# EAGLE board RADAR (EAGLE 7.4.0), part 1 of 4
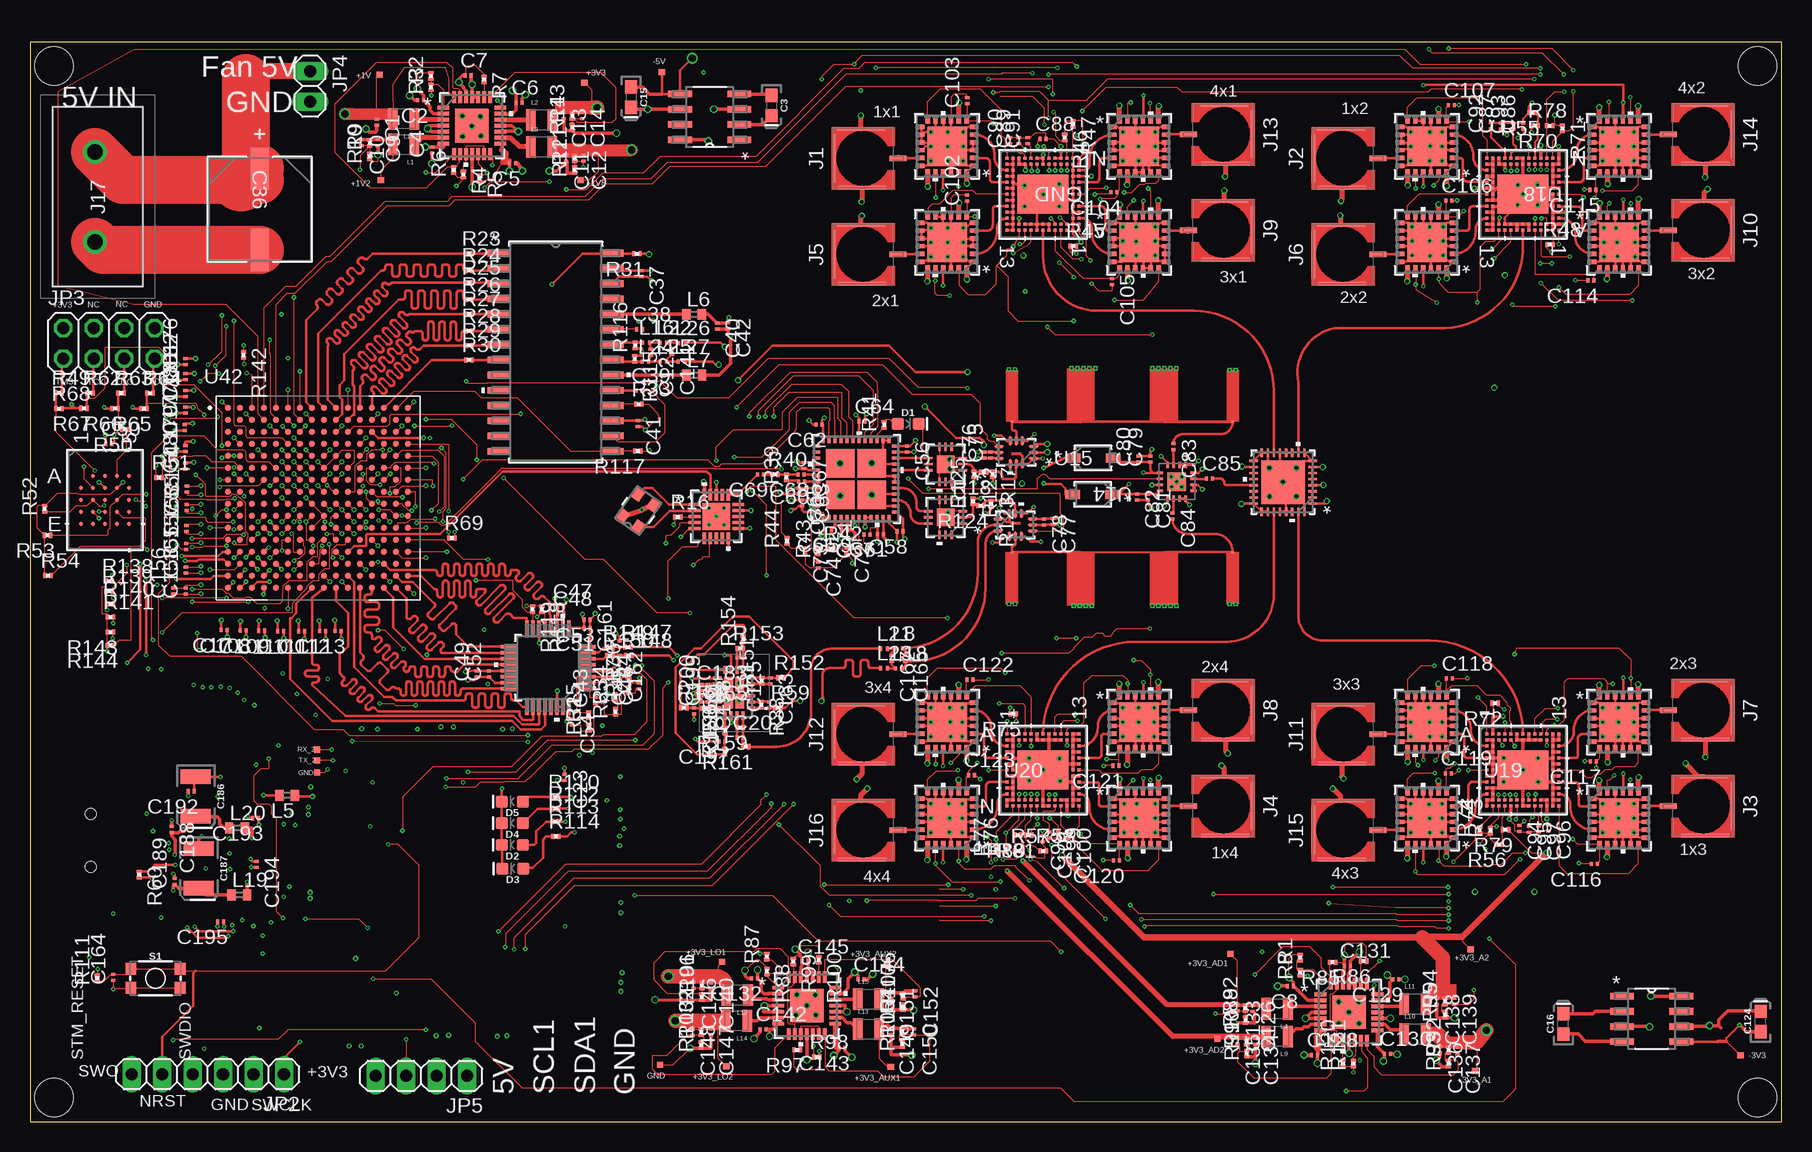
[diagram p11: board, top side]
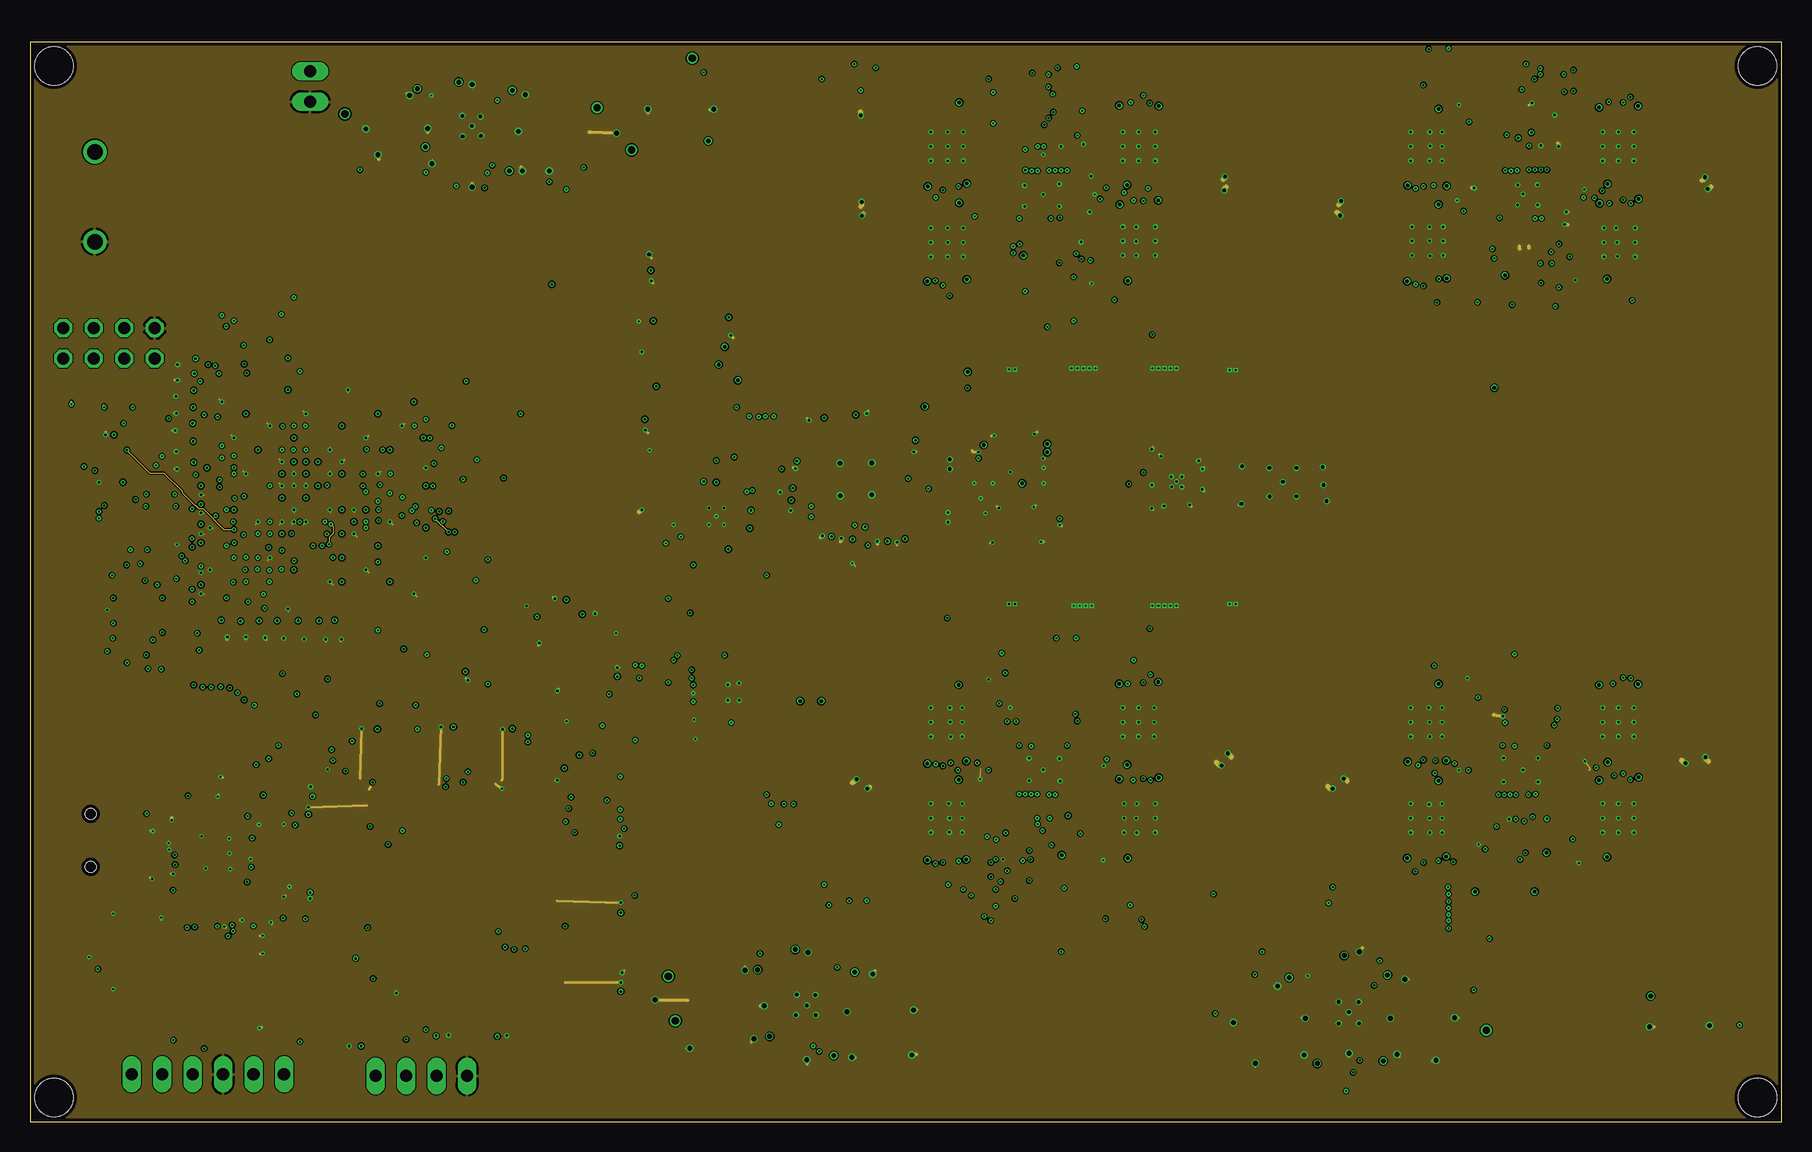
[diagram p12: board, inner layer Route2]
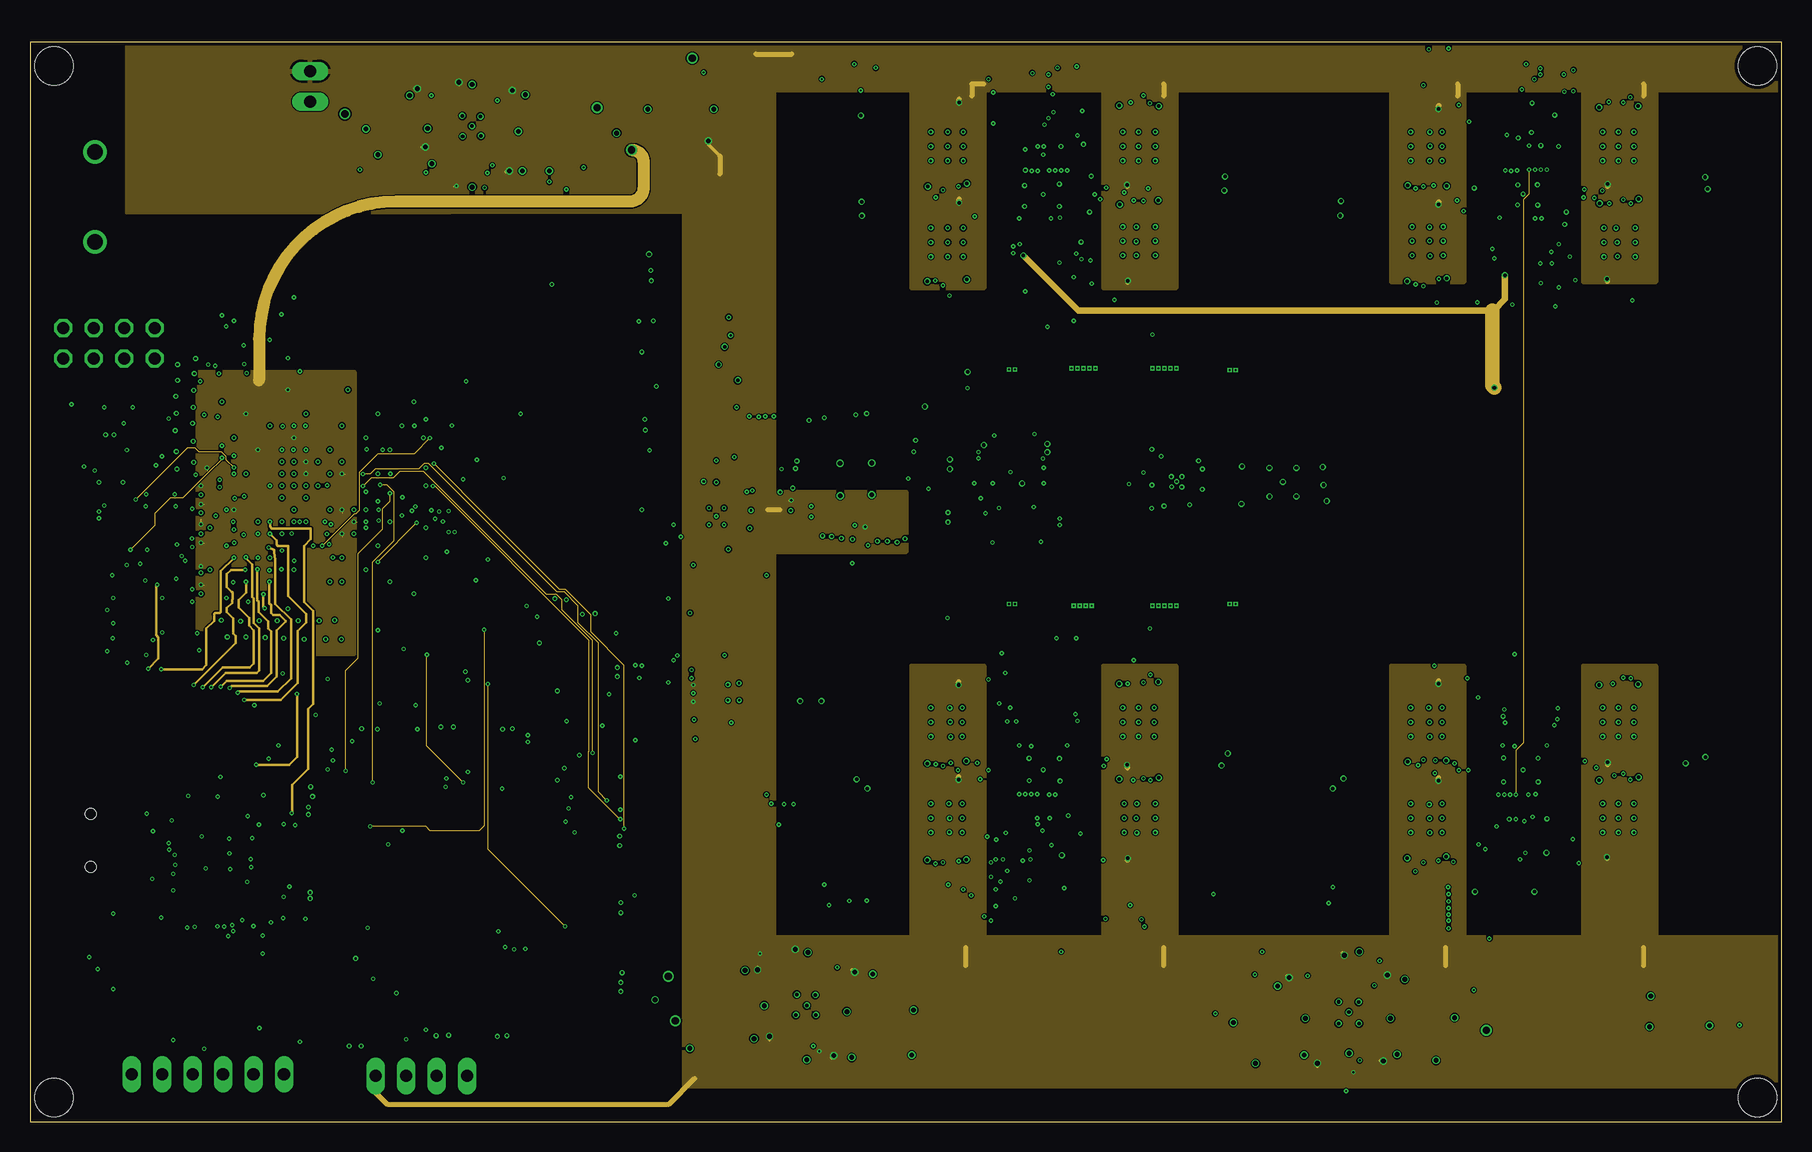
[diagram p13: board, inner layer Route3]
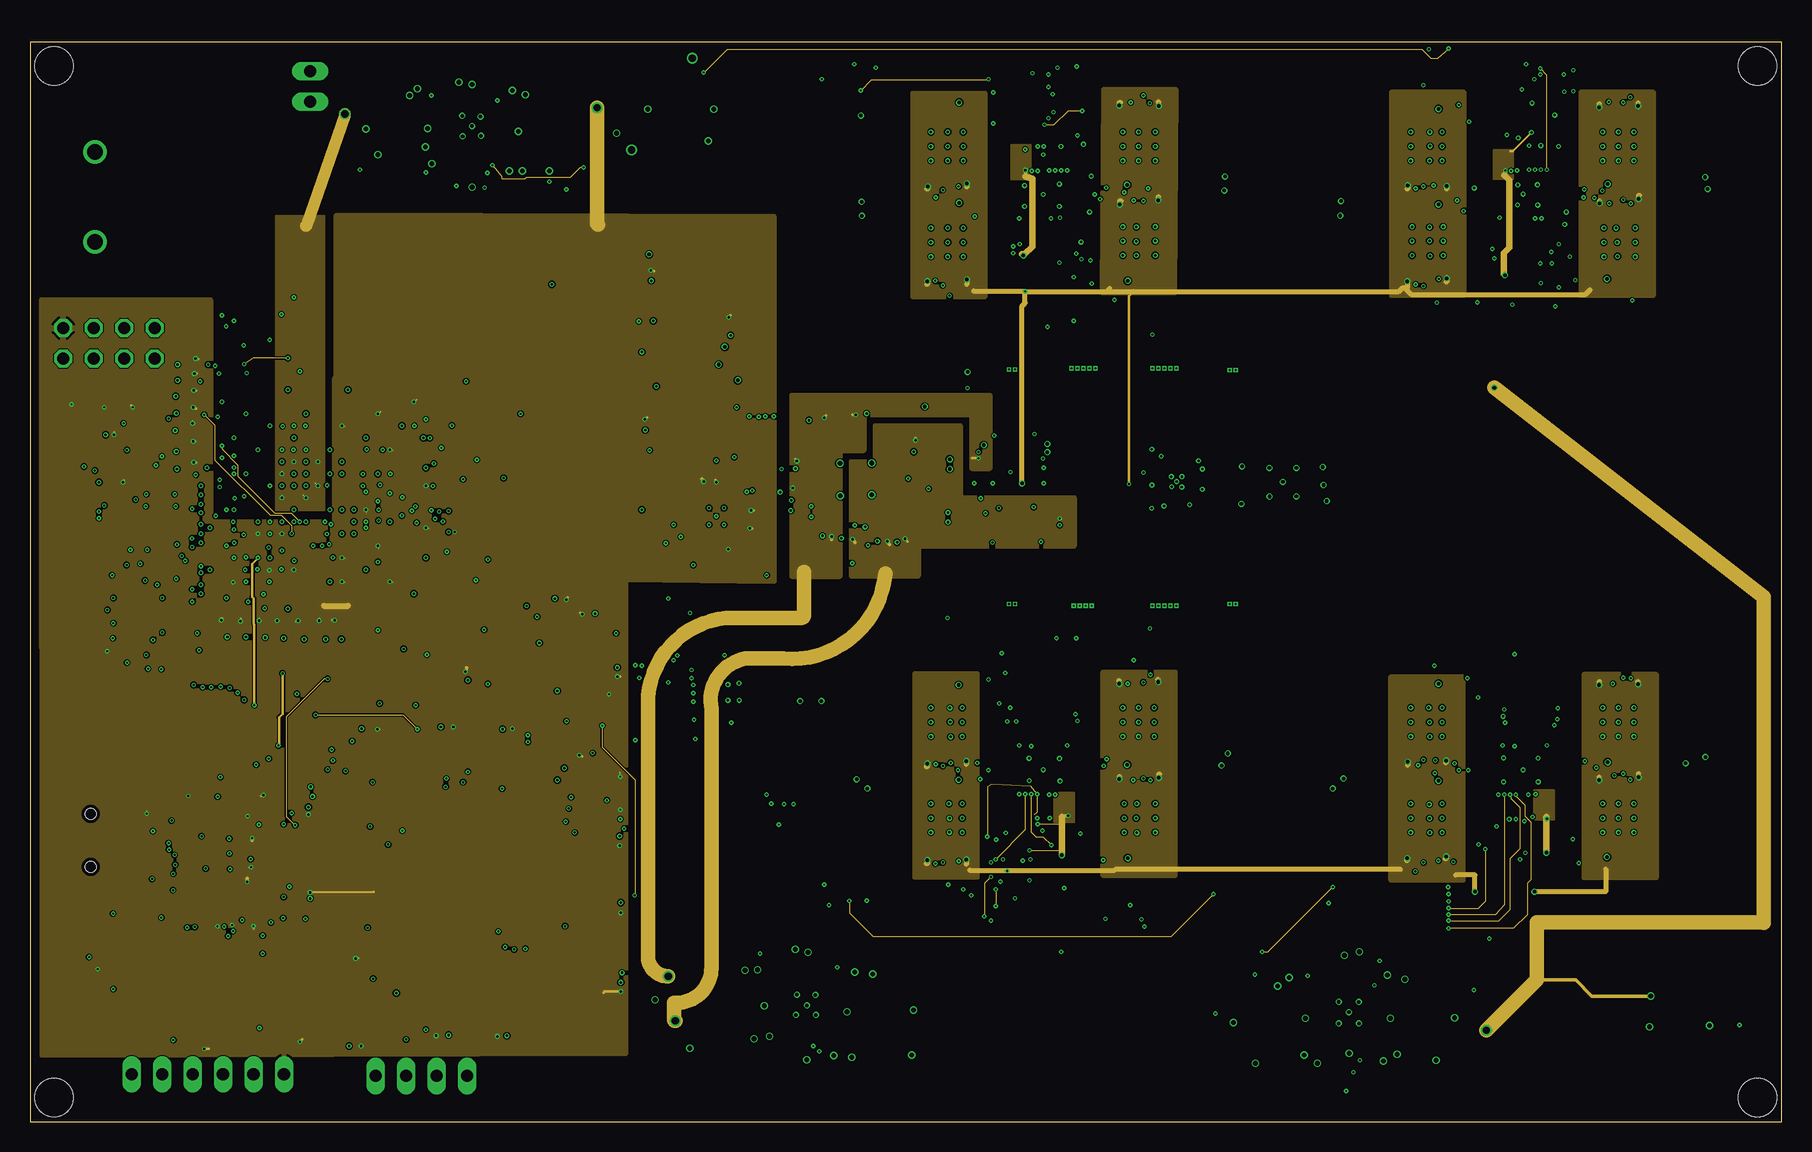
[diagram p14: board, inner layer Route14]
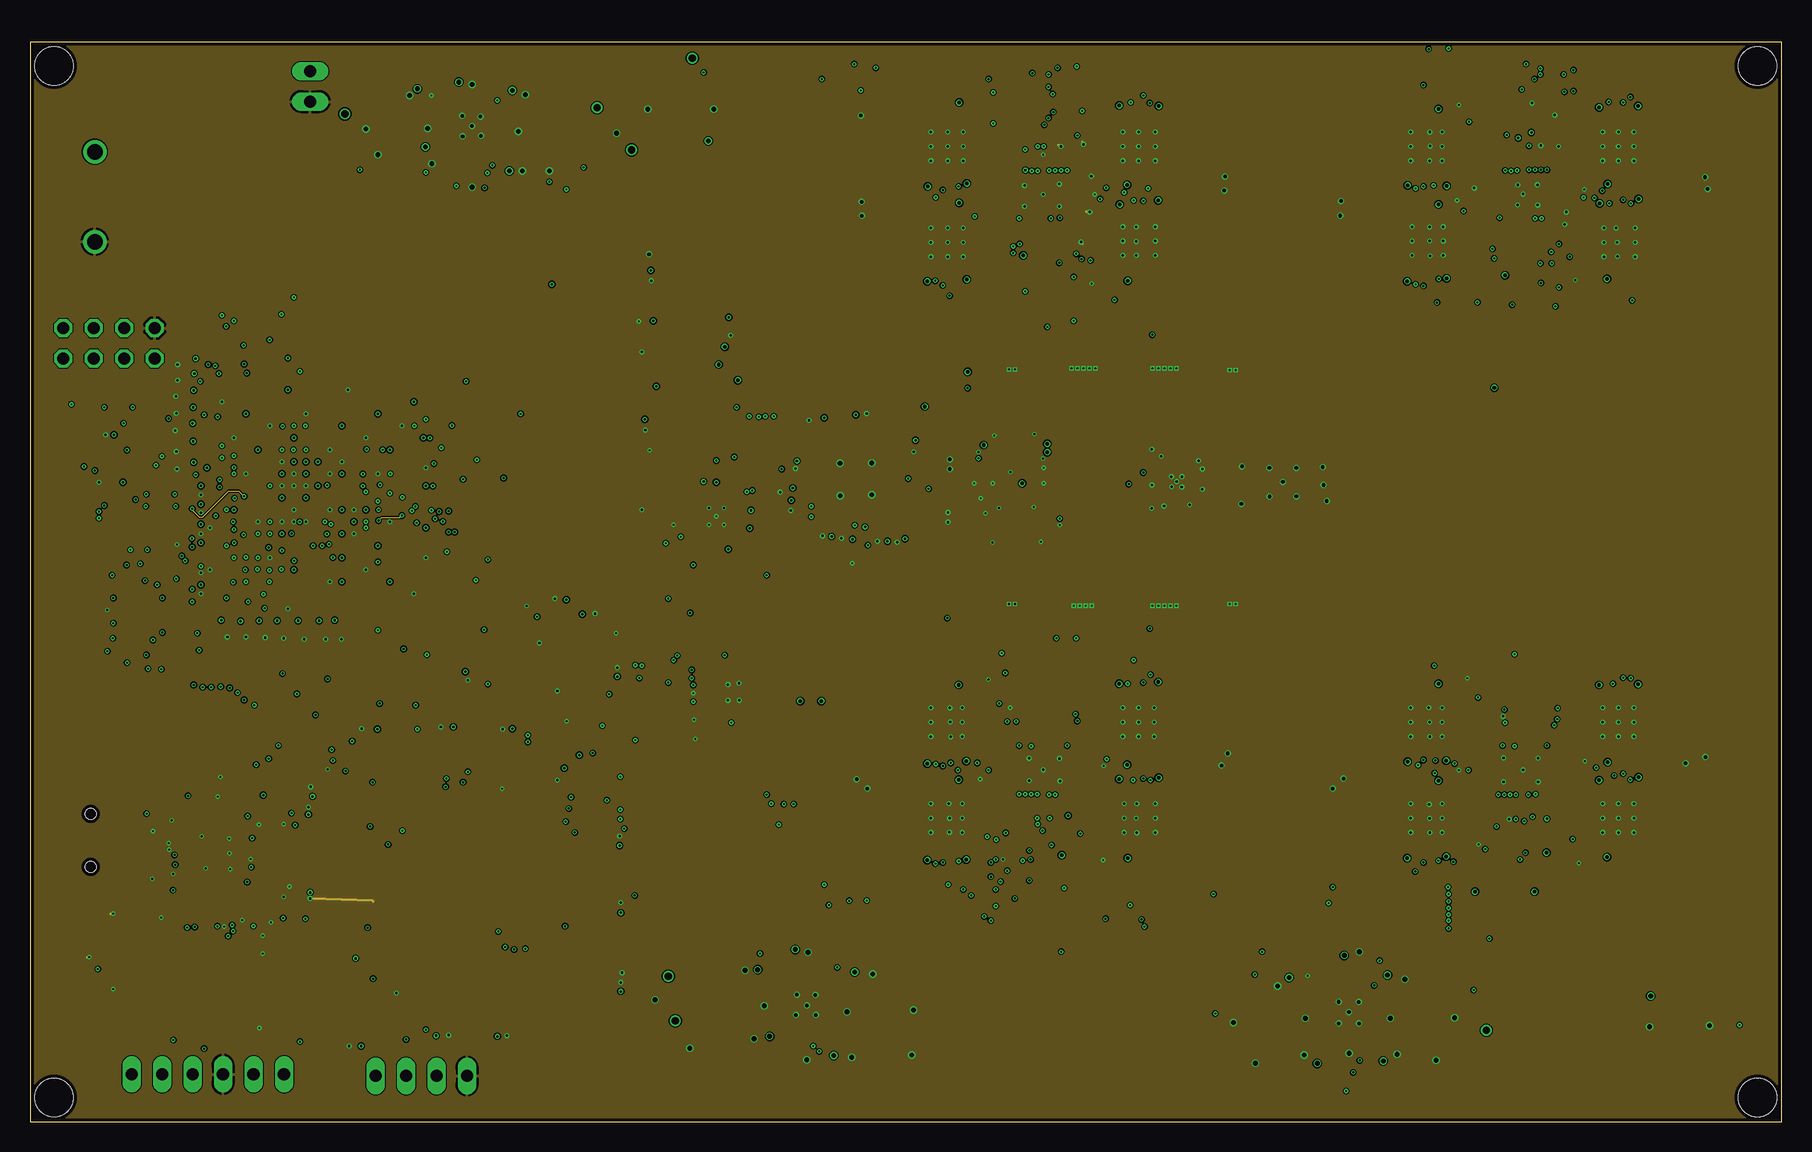
[diagram p15: board, inner layer Route15]
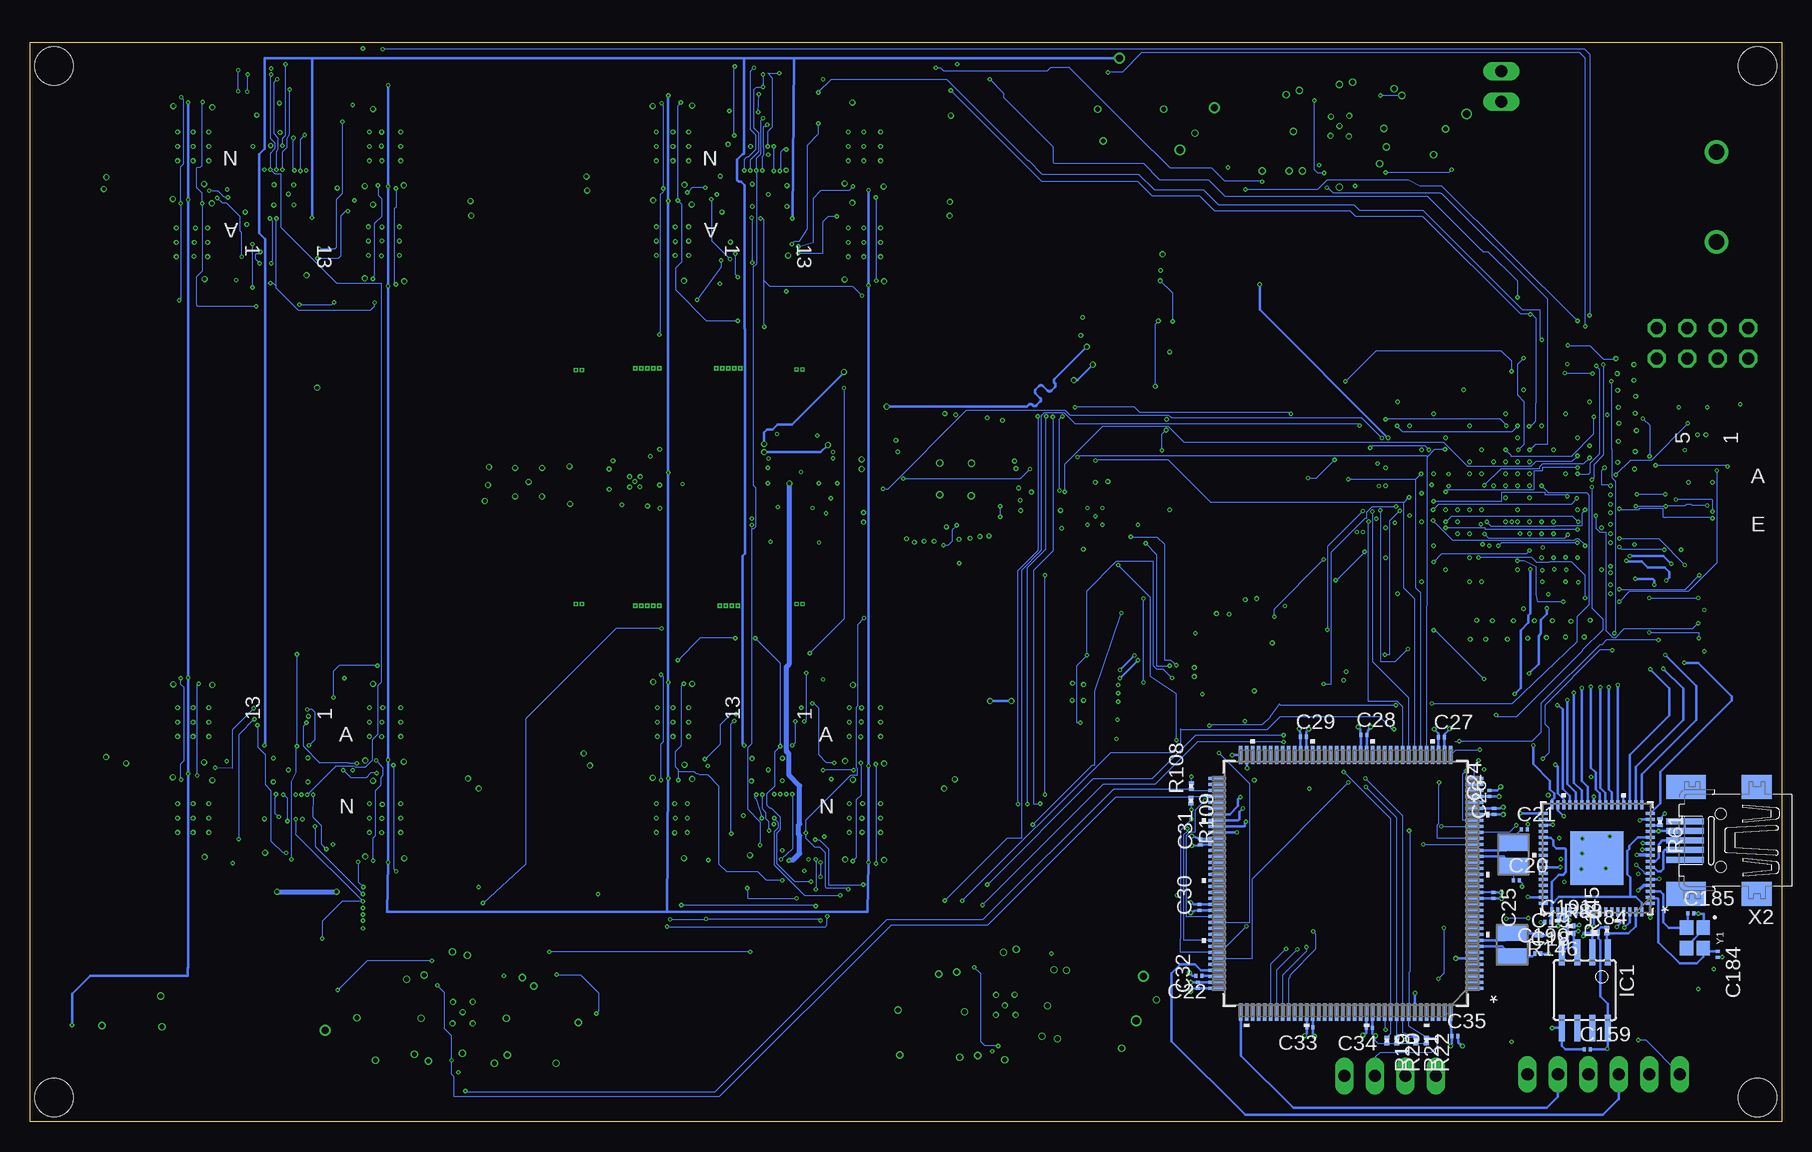
[diagram p16: board, bottom side, seen from below]

Size 146 x 90 mm. Coordinates in mm from the lower left corner, seen from the top.
Outline: 0,0 146,0 146,90 0,90 0,0
Copper layers (1*2+3*14+15*16): Top 0.035mm / dielectric 0.1mm / Route2 0.035mm / dielectric 0.695mm / Route3 0.035mm / dielectric 0.25mm / Route14 0.035mm / dielectric 0.6mm / Route15 0.035mm / dielectric 0.1mm / Bottom 0.035mm
Design rules "PCBWay_6L_100um-Track *": minimum track width 0.08mm, minimum drill 0.15mm, track to track 0.1mm, track to pad 0.1mm, pad to pad 0.1mm, via to via 0.1mm, smd to smd 0mil, copper to edge 0.3mm, drill to drill 10mil, minimum pad ring 6mil, minimum via ring 0.1mm, stop-mask expansion 2mil, vias tented up to drill 0.45mm, thermal gap 0.2mm
Holes 3.2 mm at 2,2 144,2 144,88 2,88

## Footprints (pad centres in the part's own frame; a part is rotated, then mirrored left to right if it is on the bottom)
C0201 = smd 0.25 x 0.35: 1 -0.25,0; 2 0.25,0
0603-POLAR = smd 1.1 x 1: + 0.85,0; - -0.85,0
PCAP_8X10-ELECT_NCA = smd 3.505 x 1.499: 1 -3.404,0; 2 3.404,0
EIA3528 = smd 1.2 x 2.5: A 1.65,0; C -1.65,0
LED-0603 = smd 1 x 1: A -0.877,0; C 0.877,0
CC-88-1_ADI = smd 4.242 x 3.251: 89 0,0 | smd 0.254 x 0.254: A1 -3,3; A2 -2.5,3; A3 -2,3; A4 -1.5,3; A5 -1,3; A6 -0.5,3; A7 0,3; A8 0.5,3; A9 1,3; A10 1.5,3; A11 2,3; A12 2.5,3; A13 3,3; B1 -3,2.5; B2 -2.5,2.5; B3 -2,2.5; B4 -1.5,2.5; B5 -1,2.5; B6 -0.5,2.5; B7 0,2.5; B8 0.5,2.5; B9 1,2.5; B10 1.5,2.5; B11 2,2.5; B12 2.5,2.5; B13 3,2.5; C1 -3,2; C2 -2.5,2; C12 2.5,2; C13 3,2; D1 -3,1.5; D2 -2.5,1.5; D12 2.5,1.5; D13 3,1.5; E1 -3,1; E2 -2.5,1; E12 2.5,1; E13 3,1; F1 -3,0.5; F2 -2.5,0.5; F12 2.5,0.5; F13 3,0.5; G1 -3,0; G2 -2.5,0; G12 2.5,0; G13 3,0; H1 -3,-0.5; H2 -2.5,-0.5; H12 2.5,-0.5; H13 3,-0.5; J1 -3,-1; J2 -2.5,-1; J12 2.5,-1; J13 3,-1; K1 -3,-1.5; K2 -2.5,-1.5; K12 2.5,-1.5; K13 3,-1.5; L1 -3,-2; L2 -2.5,-2; L12 2.5,-2; L13 3,-2; M1 -3,-2.5; M2 -2.5,-2.5; M3 -2,-2.5; M4 -1.5,-2.5; M5 -1,-2.5; M6 -0.5,-2.5; M7 0,-2.5; M8 0.5,-2.5; M9 1,-2.5; M10 1.5,-2.5; M11 2,-2.5; M12 2.5,-2.5; M13 3,-2.5; N1 -3,-3; N2 -2.5,-3; N3 -2,-3; N4 -1.5,-3; N5 -1,-3; N6 -0.5,-3; N7 0,-3; N8 0.5,-3; N9 1,-3; N10 1.5,-3; N11 2,-3; N12 2.5,-3; N13 3,-3
SOIC8 = smd 0.5 x 2.2: 1 -1.905,-3.154; 2 -0.645,-3.154; 3 0.625,-3.154; 4 1.895,-3.154; 5 1.905,3.154; 6 0.635,3.154; 7 -0.635,3.154; 8 -1.905,3.154
LTC6419IVPBF = smd 0.7 x 0.25: 1 -1.4,1.25; 2 -1.4,0.75; 3 -1.4,0.25; 4 -1.4,-0.25; 5 -1.4,-0.75; 6 -1.4,-1.25; 11 1.4,-1.25; 12 1.4,-0.75; 13 1.4,-0.25; 14 1.4,0.25; 15 1.4,0.75; 16 1.4,1.25 | smd 0.25 x 0.7: 7 -0.75,-1.9; 8 -0.25,-1.9; 9 0.25,-1.9; 10 0.75,-1.9; 17 0.75,1.9; 18 0.25,1.9; 19 -0.25,1.9; 20 -0.75,1.9 | smd 0.725 x 1.225: 21 -0.462,0.713; 22 0.463,0.713; 23 -0.462,-0.713; 24 0.463,-0.713
60124102122403 = smd 0.48 x 1.4: 1 0,-2.9 | smd 0.3 x 4: 2 -2.45,0.1; 4 2.45,0.2 | smd 4 x 0.3: 3 0,2.45
691137910002 = drill 1.3 pad 1.95: 1 0,0; 2 7.5,0
1X06 = drill 1.016 long: 1 -6.35,0; 2 -3.81,0; 3 -1.27,0; 4 1.27,0; 5 3.81,0; 6 6.35,0
2X04 = drill 1.016 octagon: 1 -3.81,-1.27; 2 -3.81,1.27; 3 -1.27,-1.27; 4 -1.27,1.27; 5 1.27,-1.27; 6 1.27,1.27; 7 3.81,-1.27; 8 3.81,1.27
1X02 = drill 1.016 long: 1 -1.27,0; 2 1.27,0
1X04 = drill 1.016 long: 1 -3.81,0; 2 -1.27,0; 3 1.27,0; 4 3.81,0
0806 = smd 0.8 x 1.8: 1 -0.9,0; 2 0.9,0
0402 = smd 0.7 x 0.9: 1 -0.65,0; 2 0.65,0
L0201 = smd 0.25 x 0.35: 1 -0.275,0; 2 0.275,0
R0201 = smd 0.28 x 0.43: 1 -0.255,0; 2 0.255,0
TACTILE_SWITCH_SMD_4.6X2.8MM = smd 0.9 x 1: 1 -2.05,-0.8; 2 2.05,-0.8; 3 2.05,0.8; 4 -2.05,0.8
PAD.02X.02 = smd 0.508 x 0.508: 1 0,0
21-0140L_T2855-5_MXM = smd 0.965 x 0.305: 1 -2.375,1.5; 2 -2.375,1; 3 -2.375,0.5; 4 -2.375,0; 5 -2.375,-0.5; 6 -2.375,-1; 7 -2.375,-1.5; 15 2.375,-1.5; 16 2.375,-1; 17 2.375,-0.5; 18 2.375,0; 19 2.375,0.5; 20 2.375,1; 21 2.375,1.5 | smd 0.305 x 0.965: 8 -1.5,-2.375; 9 -1,-2.375; 10 -0.5,-2.375; 11 0,-2.375; 12 0.5,-2.375; 13 1,-2.375; 14 1.5,-2.375; 22 1.5,2.375; 23 1,2.375; 24 0.5,2.375; 25 0,2.375; 26 -0.5,2.375; 27 -1,2.375; 28 -1.5,2.375 | smd 2.794 x 2.794: 29 0,0
LQFP-144_STM = smd 1.473 x 0.279: 1 -10.719,8.75; 2 -10.719,8.25; 3 -10.719,7.75; 4 -10.719,7.25; 5 -10.719,6.75; 6 -10.719,6.25; 7 -10.719,5.75; 8 -10.719,5.25; 9 -10.719,4.75; 10 -10.719,4.25; 11 -10.719,3.75; 12 -10.719,3.25; 13 -10.719,2.75; 14 -10.719,2.25; 15 -10.719,1.75; 16 -10.719,1.25; 17 -10.719,0.75; 18 -10.719,0.25; 19 -10.719,-0.25; 20 -10.719,-0.75; 21 -10.719,-1.25; 22 -10.719,-1.75; 23 -10.719,-2.25; 24 -10.719,-2.75; 25 -10.719,-3.25; 26 -10.719,-3.75; 27 -10.719,-4.25; 28 -10.719,-4.75; 29 -10.719,-5.25; 30 -10.719,-5.75; 31 -10.719,-6.25; 32 -10.719,-6.75; 33 -10.719,-7.25; 34 -10.719,-7.75; 35 -10.719,-8.25; 36 -10.719,-8.75; 73 10.719,-8.75; 74 10.719,-8.25; 75 10.719,-7.75; 76 10.719,-7.25; 77 10.719,-6.75; 78 10.719,-6.25; 79 10.719,-5.75; 80 10.719,-5.25; 81 10.719,-4.75; 82 10.719,-4.25; 83 10.719,-3.75; 84 10.719,-3.25; 85 10.719,-2.75; 86 10.719,-2.25; 87 10.719,-1.75; 88 10.719,-1.25; 89 10.719,-0.75; 90 10.719,-0.25; 91 10.719,0.25; 92 10.719,0.75; 93 10.719,1.25; 94 10.719,1.75; 95 10.719,2.25; 96 10.719,2.75; 97 10.719,3.25; 98 10.719,3.75; 99 10.719,4.25; 100 10.719,4.75; 101 10.719,5.25; 102 10.719,5.75; 103 10.719,6.25; 104 10.719,6.75; 105 10.719,7.25; 106 10.719,7.75; 107 10.719,8.25; 108 10.719,8.75 | smd 0.279 x 1.473: 37 -8.75,-10.719; 38 -8.25,-10.719; 39 -7.75,-10.719; 40 -7.25,-10.719; 41 -6.75,-10.719; 42 -6.25,-10.719; 43 -5.75,-10.719; 44 -5.25,-10.719; 45 -4.75,-10.719; 46 -4.25,-10.719; 47 -3.75,-10.719; 48 -3.25,-10.719; 49 -2.75,-10.719; 50 -2.25,-10.719; 51 -1.75,-10.719; 52 -1.25,-10.719; 53 -0.75,-10.719; 54 -0.25,-10.719; 55 0.25,-10.719; 56 0.75,-10.719; 57 1.25,-10.719; 58 1.75,-10.719; 59 2.25,-10.719; 60 2.75,-10.719; 61 3.25,-10.719; 62 3.75,-10.719; 63 4.25,-10.719; 64 4.75,-10.719; 65 5.25,-10.719; 66 5.75,-10.719; 67 6.25,-10.719; 68 6.75,-10.719; 69 7.25,-10.719; 70 7.75,-10.719; 71 8.25,-10.719; 72 8.75,-10.719; 109 8.75,10.719; 110 8.25,10.719; 111 7.75,10.719; 112 7.25,10.719; 113 6.75,10.719; 114 6.25,10.719; 115 5.75,10.719; 116 5.25,10.719; 117 4.75,10.719; 118 4.25,10.719; 119 3.75,10.719; 120 3.25,10.719; 121 2.75,10.719; 122 2.25,10.719; 123 1.75,10.719; 124 1.25,10.719; 125 0.75,10.719; 126 0.25,10.719; 127 -0.25,10.719; 128 -0.75,10.719; 129 -1.25,10.719; 130 -1.75,10.719; 131 -2.25,10.719; 132 -2.75,10.719; 133 -3.25,10.719; 134 -3.75,10.719; 135 -4.25,10.719; 136 -4.75,10.719; 137 -5.25,10.719; 138 -5.75,10.719; 139 -6.25,10.719; 140 -6.75,10.719; 141 -7.25,10.719; 142 -7.75,10.719; 143 -8.25,10.719; 144 -8.75,10.719
RW_28_ADI = smd 1.981 x 0.559: 1 -4.686,8.255; 2 -4.686,6.985; 3 -4.686,5.715; 4 -4.686,4.445; 5 -4.686,3.175; 6 -4.686,1.905; 7 -4.686,0.635; 8 -4.686,-0.635; 9 -4.686,-1.905; 10 -4.686,-3.175; 11 -4.686,-4.445; 12 -4.686,-5.715; 13 -4.686,-6.985; 14 -4.686,-8.255; 15 4.686,-8.255; 16 4.686,-6.985; 17 4.686,-5.715; 18 4.686,-4.445; 19 4.686,-3.175; 20 4.686,-1.905; 21 4.686,-0.635; 22 4.686,0.635; 23 4.686,1.905; 24 4.686,3.175; 25 4.686,4.445; 26 4.686,5.715; 27 4.686,6.985; 28 4.686,8.255
21-0110B_MXM = smd 1.346 x 0.279: 1 -3.277,1.75; 2 -3.277,1.25; 3 -3.277,0.75; 4 -3.277,0.25; 5 -3.277,-0.25; 6 -3.277,-0.75; 7 -3.277,-1.25; 8 -3.277,-1.75; 17 3.277,-1.75; 18 3.277,-1.25; 19 3.277,-0.75; 20 3.277,-0.25; 21 3.277,0.25; 22 3.277,0.75; 23 3.277,1.25; 24 3.277,1.75 | smd 0.279 x 1.346: 9 -1.75,-3.277; 10 -1.25,-3.277; 11 -0.75,-3.277; 12 -0.25,-3.277; 13 0.25,-3.277; 14 0.75,-3.277; 15 1.25,-3.277; 16 1.75,-3.277; 25 1.75,3.277; 26 1.25,3.277; 27 0.75,3.277; 28 0.25,3.277; 29 -0.25,3.277; 30 -0.75,3.277; 31 -1.25,3.277; 32 -1.75,3.277
UDB_12_ADI = smd 0.813 x 0.254: 1 -1.448,0.5; 2 -1.448,0; 3 -1.448,-0.5; 7 1.448,-0.5; 8 1.448,0; 9 1.448,0.5 | smd 0.254 x 0.813: 4 -0.5,-0.953; 5 0,-0.953; 6 0.5,-0.953; 10 0.5,0.953; 11 0,0.953; 12 -0.5,0.953
64QFN_FT2232HQ_FTD = smd 0.755 x 0.254: 1 -4.461,3.75; 2 -4.461,3.25; 3 -4.461,2.75; 4 -4.461,2.25; 5 -4.461,1.75; 6 -4.461,1.25; 7 -4.461,0.75; 8 -4.461,0.25; 9 -4.461,-0.25; 10 -4.461,-0.75; 11 -4.461,-1.25; 12 -4.461,-1.75; 13 -4.461,-2.25; 14 -4.461,-2.75; 15 -4.461,-3.25; 16 -4.461,-3.75; 33 4.461,-3.75; 34 4.461,-3.25; 35 4.461,-2.75; 36 4.461,-2.25; 37 4.461,-1.75; 38 4.461,-1.25; 39 4.461,-0.75; 40 4.461,-0.25; 41 4.461,0.25; 42 4.461,0.75; 43 4.461,1.25; 44 4.461,1.75; 45 4.461,2.25; 46 4.461,2.75; 47 4.461,3.25; 48 4.461,3.75 | smd 0.254 x 0.755: 17 -3.75,-4.461; 18 -3.25,-4.461; 19 -2.75,-4.461; 20 -2.25,-4.461; 21 -1.75,-4.461; 22 -1.25,-4.461; 23 -0.75,-4.461; 24 -0.25,-4.461; 25 0.25,-4.461; 26 0.75,-4.461; 27 1.25,-4.461; 28 1.75,-4.461; 29 2.25,-4.461; 30 2.75,-4.461; 31 3.25,-4.461; 32 3.75,-4.461; 49 3.75,4.461; 50 3.25,4.461; 51 2.75,4.461; 52 2.25,4.461; 53 1.75,4.461; 54 1.25,4.461; 55 0.75,4.461; 56 0.25,4.461; 57 -0.25,4.461; 58 -0.75,4.461; 59 -1.25,4.461; 60 -1.75,4.461; 61 -2.25,4.461; 62 -2.75,4.461; 63 -3.25,4.461; 64 -3.75,4.461 | smd 4.445 x 4.445: 65 0,0
CC-48-10_ADI = smd 0.457 x 0.254: 1 -3.226,2.75; 2 -3.226,2.25; 3 -3.226,1.75; 4 -3.226,1.25; 5 -3.226,0.75; 6 -3.226,0.25; 7 -3.226,-0.25; 8 -3.226,-0.75; 9 -3.226,-1.25; 10 -3.226,-1.75; 11 -3.226,-2.25; 12 -3.226,-2.75; 25 3.226,-2.75; 26 3.226,-2.25; 27 3.226,-1.75; 28 3.226,-1.25; 29 3.226,-0.75; 30 3.226,-0.25; 31 3.226,0.25; 32 3.226,0.75; 33 3.226,1.25; 34 3.226,1.75; 35 3.226,2.25; 36 3.226,2.75 | smd 0.254 x 0.457: 13 -2.75,-3.226; 14 -2.25,-3.226; 15 -1.75,-3.226; 16 -1.25,-3.226; 17 -0.75,-3.226; 18 -0.25,-3.226; 19 0.25,-3.226; 20 0.75,-3.226; 21 1.25,-3.226; 22 1.75,-3.226; 23 2.25,-3.226; 24 2.75,-3.226; 37 2.75,3.226; 38 2.25,3.226; 39 1.75,3.226; 40 1.25,3.226; 41 0.75,3.226; 42 0.25,3.226; 43 -0.25,3.226; 44 -0.75,3.226; 45 -1.25,3.226; 46 -1.75,3.226; 47 -2.25,3.226; 48 -2.75,3.226 | smd 2.388 x 2.388: 49 -1.312,1.312; 50 -1.312,-1.312; 51 1.312,-1.312; 52 1.312,1.312
M08A = smd 1.981 x 0.559: 1 -2.464,1.905; 2 -2.464,0.635; 3 -2.464,-0.635; 4 -2.464,-1.905; 5 2.464,-1.905; 6 2.464,-0.635; 7 2.464,0.635; 8 2.464,1.905
BGA24_MT25QL_MRN = smd 0.33 x 0.33: A2 -1,2; A3 0,2; A4 1,2; A5 2,2; B1 -2,1; B2 -1,1; B3 0,1; B4 1,1; B5 2,1; C1 -2,0; C2 -1,0; C3 0,0; C4 1,0; C5 2,0; D1 -2,-1; D2 -1,-1; D3 0,-1; D4 1,-1; D5 2,-1; E1 -2,-2; E2 -1,-2; E3 0,-2; E4 1,-2; E5 2,-2
QFN20_SIL = smd 0.965 x 0.254: 1 -1.816,1; 2 -1.816,0.5; 3 -1.816,0; 4 -1.816,-0.5; 5 -1.816,-1; 11 1.816,-1; 12 1.816,-0.5; 13 1.816,0; 14 1.816,0.5; 15 1.816,1 | smd 0.254 x 0.965: 6 -1,-1.816; 7 -0.5,-1.816; 8 0,-1.816; 9 0.5,-1.816; 10 1,-1.816; 16 1,1.816; 17 0.5,1.816; 18 0,1.816; 19 -0.5,1.816; 20 -1,1.816 | smd 2.261 x 2.261: 21 0,0
DQ1225_MNC = smd 0.711 x 0.178: 1 -1.448,0.508; 2 -1.448,0; 3 -1.448,-0.508; 7 1.448,-0.508; 8 1.448,0; 9 1.448,0.508 | smd 0.178 x 0.711: 4 -0.508,-1.448; 5 0,-1.448; 6 0.508,-1.448; 10 0.508,1.448; 11 0,1.448; 12 -0.508,1.448 | smd 1.448 x 1.448: 13 0,0
SOD-123_ONS = smd 1.219 x 0.762: 1 -1.676,0; 2 1.676,0
DG1677-2_MNC = smd 0.711 x 0.178: 1 -2.451,1.778; 2 -2.451,1.27; 3 -2.451,0.762; 4 -2.451,0.254; 5 -2.451,-0.254; 6 -2.451,-0.762; 7 -2.451,-1.27; 8 -2.451,-1.778; 17 2.451,-1.778; 18 2.451,-1.27; 19 2.451,-0.762; 20 2.451,-0.254; 21 2.451,0.254; 22 2.451,0.762; 23 2.451,1.27; 24 2.451,1.778 | smd 0.178 x 0.711: 9 -1.778,-2.451; 10 -1.27,-2.451; 11 -0.762,-2.451; 12 -0.254,-2.451; 13 0.254,-2.451; 14 0.762,-2.451; 15 1.27,-2.451; 16 1.778,-2.451; 25 1.778,2.451; 26 1.27,2.451; 27 0.762,2.451; 28 0.254,2.451; 29 -0.254,2.451; 30 -0.762,2.451; 31 -1.27,2.451; 32 -1.778,2.451 | smd 3.607 x 3.607: 33 0,0
CC-24-8_ADI = smd 0.508 x 0.356: 1 -2.146,1.625; 2 -2.146,0.975; 3 -2.146,0.325; 4 -2.146,-0.325; 5 -2.146,-0.975; 6 -2.146,-1.625; 13 2.146,-1.625; 14 2.146,-0.975; 15 2.146,-0.325; 16 2.146,0.325; 17 2.146,0.975; 18 2.146,1.625 | smd 0.356 x 0.508: 7 -1.625,-2.146; 8 -0.975,-2.146; 9 -0.325,-2.146; 10 0.325,-2.146; 11 0.975,-2.146; 12 1.625,-2.146; 19 1.625,2.146; 20 0.975,2.146; 21 0.325,2.146; 22 -0.325,2.146; 23 -0.975,2.146; 24 -1.625,2.146 | smd 3.302 x 3.302: 25 0,0
BGA256C100P16X16_1700X1700X155 = smd 0.45 x 0.45: A1 -7.5,7.5; A2 -6.5,7.5; A3 -5.5,7.5; A4 -4.5,7.5; A5 -3.5,7.5; A6 -2.5,7.5; A7 -1.5,7.5; A8 -0.5,7.5; A9 0.5,7.5; A10 1.5,7.5; A11 2.5,7.5; A12 3.5,7.5; A13 4.5,7.5; A14 5.5,7.5; A15 6.5,7.5; A16 7.5,7.5; B1 -7.5,6.5; B2 -6.5,6.5; B3 -5.5,6.5; B4 -4.5,6.5; B5 -3.5,6.5; B6 -2.5,6.5; B7 -1.5,6.5; B8 -0.5,6.5; B9 0.5,6.5; B10 1.5,6.5; B11 2.5,6.5; B12 3.5,6.5; B13 4.5,6.5; B14 5.5,6.5; B15 6.5,6.5; B16 7.5,6.5; C1 -7.5,5.5; C2 -6.5,5.5; C3 -5.5,5.5; C4 -4.5,5.5; C5 -3.5,5.5; C6 -2.5,5.5; C7 -1.5,5.5; C8 -0.5,5.5; C9 0.5,5.5; C10 1.5,5.5; C11 2.5,5.5; C12 3.5,5.5; C13 4.5,5.5; C14 5.5,5.5; C15 6.5,5.5; C16 7.5,5.5; D1 -7.5,4.5; D2 -6.5,4.5; D3 -5.5,4.5; D4 -4.5,4.5; D5 -3.5,4.5; D6 -2.5,4.5; D7 -1.5,4.5; D8 -0.5,4.5; D9 0.5,4.5; D10 1.5,4.5; D11 2.5,4.5; D12 3.5,4.5; D13 4.5,4.5; D14 5.5,4.5; D15 6.5,4.5; D16 7.5,4.5; E1 -7.5,3.5; E2 -6.5,3.5; E3 -5.5,3.5; E4 -4.5,3.5; E5 -3.5,3.5; E6 -2.5,3.5; E7 -1.5,3.5; E8 -0.5,3.5; E9 0.5,3.5; E10 1.5,3.5; E11 2.5,3.5; E12 3.5,3.5; E13 4.5,3.5; E14 5.5,3.5; E15 6.5,3.5; E16 7.5,3.5; F1 -7.5,2.5; F2 -6.5,2.5; F3 -5.5,2.5; F4 -4.5,2.5; F5 -3.5,2.5; F6 -2.5,2.5; F7 -1.5,2.5; F8 -0.5,2.5; F9 0.5,2.5; F10 1.5,2.5; F11 2.5,2.5; F12 3.5,2.5; F13 4.5,2.5; F14 5.5,2.5; F15 6.5,2.5; F16 7.5,2.5; G1 -7.5,1.5; G2 -6.5,1.5; G3 -5.5,1.5; G4 -4.5,1.5; G5 -3.5,1.5; G6 -2.5,1.5; G7 -1.5,1.5; G8 -0.5,1.5; G9 0.5,1.5; G10 1.5,1.5; G11 2.5,1.5; G12 3.5,1.5; G13 4.5,1.5; G14 5.5,1.5; G15 6.5,1.5; G16 7.5,1.5; H1 -7.5,0.5; H2 -6.5,0.5; H3 -5.5,0.5; H4 -4.5,0.5; H5 -3.5,0.5; H6 -2.5,0.5; H7 -1.5,0.5; H8 -0.5,0.5; H9 0.5,0.5; H10 1.5,0.5; H11 2.5,0.5; H12 3.5,0.5; H13 4.5,0.5; H14 5.5,0.5; H15 6.5,0.5; H16 7.5,0.5; J1 -7.5,-0.5; J2 -6.5,-0.5; J3 -5.5,-0.5; J4 -4.5,-0.5; J5 -3.5,-0.5; J6 -2.5,-0.5; J7 -1.5,-0.5; J8 -0.5,-0.5; J9 0.5,-0.5; J10 1.5,-0.5; J11 2.5,-0.5; J12 3.5,-0.5; J13 4.5,-0.5; J14 5.5,-0.5; J15 6.5,-0.5; J16 7.5,-0.5; K1 -7.5,-1.5; K2 -6.5,-1.5; K3 -5.5,-1.5; K4 -4.5,-1.5; K5 -3.5,-1.5; K6 -2.5,-1.5; K7 -1.5,-1.5; K8 -0.5,-1.5; K9 0.5,-1.5; K10 1.5,-1.5; K11 2.5,-1.5; K12 3.5,-1.5; K13 4.5,-1.5; K14 5.5,-1.5; K15 6.5,-1.5; K16 7.5,-1.5; L1 -7.5,-2.5; L2 -6.5,-2.5; L3 -5.5,-2.5; L4 -4.5,-2.5; L5 -3.5,-2.5; L6 -2.5,-2.5; L7 -1.5,-2.5; L8 -0.5,-2.5; L9 0.5,-2.5; L10 1.5,-2.5; L11 2.5,-2.5; L12 3.5,-2.5; L13 4.5,-2.5; L14 5.5,-2.5; L15 6.5,-2.5; L16 7.5,-2.5; M1 -7.5,-3.5; M2 -6.5,-3.5; M3 -5.5,-3.5; M4 -4.5,-3.5; M5 -3.5,-3.5; M6 -2.5,-3.5; M7 -1.5,-3.5; M8 -0.5,-3.5; M9 0.5,-3.5; M10 1.5,-3.5; M11 2.5,-3.5; M12 3.5,-3.5; M13 4.5,-3.5; M14 5.5,-3.5; M15 6.5,-3.5; M16 7.5,-3.5; N1 -7.5,-4.5; N2 -6.5,-4.5; N3 -5.5,-4.5; N4 -4.5,-4.5; N5 -3.5,-4.5; N6 -2.5,-4.5; N7 -1.5,-4.5; N8 -0.5,-4.5; N9 0.5,-4.5; N10 1.5,-4.5; N11 2.5,-4.5; N12 3.5,-4.5; N13 4.5,-4.5; N14 5.5,-4.5; N15 6.5,-4.5; N16 7.5,-4.5; P1 -7.5,-5.5; P2 -6.5,-5.5; P3 -5.5,-5.5; P4 -4.5,-5.5; P5 -3.5,-5.5; P6 -2.5,-5.5; P7 -1.5,-5.5; P8 -0.5,-5.5; P9 0.5,-5.5; P10 1.5,-5.5; P11 2.5,-5.5; P12 3.5,-5.5; P13 4.5,-5.5; P14 5.5,-5.5; P15 6.5,-5.5; P16 7.5,-5.5; R1 -7.5,-6.5; R2 -6.5,-6.5; R3 -5.5,-6.5; R4 -4.5,-6.5; R5 -3.5,-6.5; R6 -2.5,-6.5; R7 -1.5,-6.5; R8 -0.5,-6.5; R9 0.5,-6.5; R10 1.5,-6.5; R11 2.5,-6.5; R12 3.5,-6.5; R13 4.5,-6.5; R14 5.5,-6.5; R15 6.5,-6.5; R16 7.5,-6.5; T1 -7.5,-7.5; T2 -6.5,-7.5; T3 -5.5,-7.5; T4 -4.5,-7.5; T5 -3.5,-7.5; T6 -2.5,-7.5; T7 -1.5,-7.5; T8 -0.5,-7.5; T9 0.5,-7.5; T10 1.5,-7.5; T11 2.5,-7.5; T12 3.5,-7.5; T13 4.5,-7.5; T14 5.5,-7.5; T15 6.5,-7.5; T16 7.5,-7.5
16_QFN = smd 0.5 x 0.22: 1 -1.4,0.74; 2 -1.4,0.24; 3 -1.4,-0.26; 4 -1.4,-0.76; 9 1.4,-0.76; 10 1.4,-0.26; 11 1.4,0.24; 12 1.4,0.74 | smd 0.22 x 0.5: 5 -0.74,-1.4; 6 -0.24,-1.4; 7 0.26,-1.4; 8 0.76,-1.4; 13 0.76,1.4; 14 0.26,1.4; 15 -0.24,1.4; 16 -0.74,1.4 | smd 1.54 x 1.54: 17 0,0
BPF2 = smd 0.169 x 0.169: P$1 0,0.1; P$2 18.415,0.1
32005-201 = smd 3.1 x 0.5: 1 3,1.6; 2 3,0.8; 3 3,0; 4 3,-0.8; 5 3,-1.6 | smd 2.5 x 2: M1 -3,-4.45; M2 -3,4.45 | smd 3.3 x 2: M3 2.9,4.45; M4 2.9,-4.45 | hole 0.9: 0,2.2; 0,-2.2
XTAL_NX3225GD-8MHZ-STD-CRA-3_N = smd 1.295 x 2.388: 1 -0.953,0; 2 0.953,0
XTAL4_CX3225SB_AVX = smd 0.762 x 1.092: 1 -0.762,1.15; 2 0.762,1.15; 3 0.762,-1.15; 4 -0.762,-1.15
CRYSTAL-SMD-2X2.5MM = smd 1.2 x 1.1: P1 0.846,0.69; P2 -0.854,0.69; P3 -0.854,-0.71; P4 0.846,-0.71

## Placement (x,y rotation side)
C1  47uF  [C0201]  28.91,83.32 270 top
C2  4.7uF  [C0201]  32.57,85.14 180 top
C3  47uF  [0603-POLAR]  61.8,84.7 270 top
C4  4.7uF  [C0201]  33.51,80.98 90 top
C5  4.7uF  [C0201]  40.24,79.9 180 top
C6  4.7uF  [C0201]  40.76,84.95 0 top
C7  1uF  [C0201]  36.5,87.21 0 top
C8  4.7uF  [C0201]  105.08,11.3 180 top
C9  47uF  [C0201]  28.97,81.6 270 top
C10  75pF  [C0201]  27.63,81.6 270 top
C11  47uF  [C0201]  44.69,80.3 270 top
C12  18pF  [C0201]  46.14,80.32 270 top
C13  47uF  [C0201]  44.48,83.85 270 top
C14  15pF  [C0201]  46.03,83.87 270 top
C15  47uF  [0603-POLAR]  50.1,85.4 270 top
C16  47uF  [0603-POLAR]  127.8,8.15 90 top
C17  47uF  [C0201]  16.18,40.99 180 top
C18  2.7pF  [C0201]  20.3,14 0 bottom
C19  2.7pF  [C0201]  20.25,15.51 0 bottom
C20  4.3pF  [C0201]  22.12,20.1 0 bottom
C21  4.3pF  [C0201]  21.45,24.36 0 bottom
C22  2.2uF  [C0201]  48.55,12.15 180 bottom
C23  2.2uF  [C0201]  44.57,28.7 270 top
C24  100nF  [C0201]  24.36,27.35 90 bottom
C25  100nF  [C0201]  24.03,18.85 270 bottom
C26  100nF  [C0201]  23.96,25.85 90 bottom
C27  100nF  [C0201]  28.35,32.05 0 bottom
C28  100nF  [C0201]  34.8,32.24 0 bottom
C29  100nF  [C0201]  39.85,32.08 0 bottom
C30  100nF  [C0201]  48.52,17.85 90 bottom
C31  47nF  [C0201]  48.46,23.3 90 bottom
C32  100nF  [C0201]  48.65,11.35 90 bottom
C33  100nF  [C0201]  39.3,7.86 180 bottom
C34  100nF  [C0201]  34.35,7.82 180 bottom
C35  100nF  [C0201]  27.25,7.12 0 bottom
C36  100µF  [PCAP_8X10-ELECT_NCA]  19.15,76.05 270 top
C37  10uF  [C0201]  50.95,70.7 270 top
C38  0.1uF  [C0201]  50.8,66.05 0 top
C39  0.1uF  [C0201]  50.75,60.95 0 top
C40  10uF  [C0201]  57.29,66.3 270 top
C41  0.1uF  [C0201]  50.67,58.18 270 top
C42  0.1uF  [C0201]  58.17,66.35 270 top
C43  0.1uF  [C0201]  47.12,35.12 90 top
C44  0.1uF  [C0201]  50.75,36.32 90 top
C45  0.1uF  [C0201]  47.77,37.33 270 top
C46  2.2uF  [C0201]  48.39,37.33 270 top
C47  0.1uF  [C0201]  44.22,42.96 0 top
C48  2.2uF  [C0201]  44.22,42.33 0 top
C49  0.1uF  [C0201]  37.25,37.32 90 top
C50  100nF  [C0201]  6.55,56.5 0 top
C51  2.2uF  [C0201]  46.43,41.13 180 top
C52  2.2uF  [C0201]  38.26,37.32 90 top
C53  0.1uF  [C0201]  46.43,41.84 180 top
C54  0.1uF  [C0201]  45.18,33.33 270 top
C55  47uF  [C0201]  13.06,51.2 90 top
C56  4.7uF  [C0201]  73.1,56.08 270 top
C57  0.1uF  [C0201]  69.78,48.93 180 top
C58  4.7uF  [C0201]  72.53,49.21 180 top
C59  4.7uF  [C0201]  67.88,49.33 180 top
C60  1uF  [C0201]  64.3,53.35 180 top
C61  4.7uF  [C0201]  70.88,48.98 180 top
C62  4.7uF  [C0201]  65.78,58.11 180 top
C63  4.7uF  [C0201]  64.74,52.57 270 top
C64  4.7uF  [C0201]  69.37,58.37 0 top
C65  4.7uF  [C0201]  64.08,52.57 270 top
C66  4.7uF  [C0201]  66.57,49.36 180 top
C67  4.7uF  [C0201]  64.5,54.68 270 top
C68  1uF  [C0201]  64.25,53.95 180 top
C69  1uF  [C0201]  60.9,53.95 180 top
C70  1uF  [C0201]  64.35,51.55 270 top
C71  20pF  [C0201]  69.15,47.55 90 top
C72  33pF  [C0201]  68.05,47.55 270 top
C73  10pF  [C0201]  64.6,47.55 270 top
C74  10nF  [C0201]  65.7,46.4 270 top
C75  18pF  [C0201]  80.09,55.56 90 top
C76  1uF  [C0201]  79.54,55.55 90 top
C77  18pF  [C0201]  85.26,50.01 270 top
C78  1uF  [C0201]  84.53,50 270 top
C79  100pF  [C0201]  93.39,55.22 90 top
C80  0.1uF  [C0201]  92.4,55.22 90 top
C81  100pF  [C0201]  93.18,52.08 270 top
C82  0.1uF  [C0201]  92.26,52.08 270 top
C83  1pF  [C0201]  95.32,56.28 270 top
C84  1pF  [C0201]  95.24,50.48 270 top
C85  1pF  [C0201]  98.32,53.61 0 top
C86  1uF  [C0201]  124.47,82.97 90 top
C87  1uF  [C0201]  122.62,83 90 top
C88  1uF  [C0201]  84.42,81.92 0 top
C89  1uF  [C0201]  82.41,81.77 90 top
C90  1uF  [C0201]  81.69,81.77 90 top
C91  1uF  [C0201]  83.17,81.77 90 top
C92  1uF  [C0201]  121.77,83.03 90 top
C93  1uF  [C0201]  123.62,82.96 90 top
C94  1uF  [C0201]  124.15,24.45 270 top
C95  1uF  [C0201]  124.95,24.37 270 top
C96  1uF  [C0201]  126.55,24.49 270 top
C97  1uF  [C0201]  125.75,24.41 270 top
C98  1uF  [C0201]  84.4,23.58 270 top
C99  1uF  [C0201]  85.7,23.9 270 top
C100  1uF  [C0201]  86.56,23.84 270 top
C101  1uF  [C0201]  84.95,23.88 270 top
C102  10nF  [C0201]  78.11,76.97 90 top
C103  10nF  [C0201]  78.12,85.12 90 top
C104  10nF  [C0201]  90.34,77.47 180 top
C105  10nF  [C0201]  90.18,70.03 270 top
C106  10nF  [C0201]  118.27,76.78 0 top
C107  10nF  [C0201]  118.49,84.73 0 top
C108  4.7uF  [C0201]  17.78,40.95 180 top
C109  4.7uF  [C0201]  19.33,40.91 180 top
C110  0.47uF  [C0201]  20.88,40.87 180 top
C111  0.47uF  [C0201]  22.63,40.88 180 top
C112  0.47uF  [C0201]  24.38,40.89 180 top
C113  0.47uF  [C0201]  25.68,40.9 180 top
C114  10nF  [C0201]  130.09,70.12 180 top
C115  10nF  [C0201]  130.28,77.67 180 top
C116  10nF  [C0201]  130.38,21.47 180 top
C117  10nF  [C0201]  130.33,30.02 180 top
C118  10nF  [C0201]  118.31,36.93 0 top
C119  10nF  [C0201]  118.22,29.03 0 top
C120  10nF  [C0201]  90.58,21.77 180 top
C121  10nF  [C0201]  90.53,29.67 180 top
C122  10nF  [C0201]  78.36,36.83 0 top
C123  10nF  [C0201]  78.47,28.88 0 top
C124  47uF  [0603-POLAR]  144.25,8.35 90 top
C125  0.4pF  [C0201]  61.6,34.75 90 top
C126  47uF  [C0201]  101.92,9.43 270 top
C127  3.2nF  [C0201]  51.75,64.15 270 top
C128  4.7uF  [C0201]  107.06,5.54 0 top
C129  4.7uF  [C0201]  113.84,11.86 180 top
C130  4.7uF  [C0201]  113.16,5.64 0 top
C131  1uF  [C0201]  109.81,12.99 0 top
C132  4.7uF  [C0201]  60.4,11.95 180 top
C133  15pF  [C0201]  100.65,9.48 270 top
C134  47uF  [C0201]  102.16,6.68 270 top
C135  15pF  [C0201]  100.64,6.68 270 top
C136  47uF  [C0201]  117.53,5.98 270 top
C137  15pF  [C0201]  118.98,5.95 270 top
C138  47uF  [C0201]  117.28,10.02 270 top
C139  15pF  [C0201]  118.71,10.03 270 top
C140  47uF  [C0201]  56.76,11.33 270 top
C141  3.2nF  [C0201]  53.5,64.2 270 top
C142  4.7uF  [C0201]  61.12,7.7 0 top
C143  4.7uF  [C0201]  67.7,6.15 180 top
C144  4.7uF  [C0201]  69.27,11.85 0 top
C145  1uF  [C0201]  64.62,13.33 0 top
C146  15pF  [C0201]  55.31,11.35 270 top
C147  47uF  [C0201]  56.76,7.47 270 top
C148  15pF  [C0201]  55.21,7.44 270 top
C149  47uF  [C0201]  71.79,7.53 270 top
C150  15pF  [C0201]  73.69,7.5 270 top
C151  47uF  [C0201]  71.79,10.52 270 top
C152  15pF  [C0201]  73.79,10.64 270 top
C153  4.7uF  [C0201]  13.04,49.45 90 top
C154  4.7uF  [C0201]  13.09,52.75 90 top
C155  0.47uF  [C0201]  13,46 90 top
C156  0.47uF  [C0201]  11.95,44.22 90 top
C157  0.47uF  [C0201]  13.02,47.95 90 top
C158  0.47uF  [C0201]  12.97,44.22 90 top
C159  0.1uF  [C0201]  16.2,6.03 0 bottom
C161  15pF  [C0201]  49.15,39.8 90 top
C162  15pF  [C0201]  49.15,38.6 270 top
C163  0.4pF  [C0201]  61.7,36.75 270 top
C164  2.2uF  [C0201]  6.94,12.04 90 top
C165  6pF  [C0201]  72.96,38.61 270 top
C167  15pF  [C0201]  71.83,38.61 270 top
C176  47uF  [C0201]  12.95,63.35 90 top
C177  4.7uF  [C0201]  12.9,57.85 90 top
C178  4.7uF  [C0201]  12.95,59.3 90 top
C179  0.47uF  [C0201]  12.95,56.1 90 top
C180  0.47uF  [C0201]  12.95,54.65 90 top
C181  0.47uF  [C0201]  12.95,60.7 90 top
C182  0.47uF  [C0201]  12.95,62.1 90 top
C183  0.4pF  [C0201]  59.2,38.7 180 top
C184  12pF  [C0201]  5.33,13.95 270 bottom
C185  12pF  [C0201]  7.55,17.35 0 bottom
C186  4.7uF 35V  [EIA3528]  13.82,27.1 270 top
C187  4.7uF 35V  [EIA3528]  14.07,21.1 270 top
C188  0.1uF  [C0201]  11.8,24.35 270 top
C189  0.1uF  [C0201]  12.05,20.02 90 top
C190  0.1uF  [C0201]  18.38,16.8 180 bottom
C191  3.3uF  [C0201]  19.48,16.62 0 bottom
C192  0.1uF  [C0201]  13.43,27.55 180 top
C193  0.1uF  [C0201]  18.82,25.3 180 top
C194  0.1uF  [C0201]  18.88,21.45 270 top
C195  0.1uF  [C0201]  15.88,16.68 180 top
C196  15pF  [C0201]  55.35,34.25 270 top
C197  15pF  [C0201]  57.7,31.7 180 top
C198  0.1uF  [C0201]  56.5,36.2 270 top
C199  1nF  [C0201]  56.5,35.25 90 top
C200  1nF  [C0201]  55.95,35.25 90 top
C201  0.1uF  [C0201]  55.95,36.2 270 top
C202  0.4pF  [C0201]  59.2,32 0 top
D1  Blue  [LED-0603]  73.2,58.15 0 top
D2  Blue  [LED-0603]  40.21,23.06 180 top
D3  Blue  [LED-0603]  40.25,21.1 180 top
D4  Blue  [LED-0603]  40.21,24.87 180 top
D5  Blue  [LED-0603]  40.21,26.68 180 top
GND  ADAR1000ACCZN  [CC-88-1_ADI]  84.45,77.3 180 top
IC1  AT93C46A-10SQ-2.7  [SOIC8]  16.4,10.95 180 bottom
IC2  LTC6419IV#PBF  [LTC6419IVPBF]  58.7,35.75 180 top
J1  60124102122403  [60124102122403]  69.45,80.3 90 top
J2  60124102122403  [60124102122403]  109.45,80.3 90 top
J3  60124102122403  [60124102122403]  139.45,26.3 270 top
J4  60124102122403  [60124102122403]  99.45,26.3 270 top
J5  60124102122403  [60124102122403]  69.45,72.3 90 top
J6  60124102122403  [60124102122403]  109.45,72.3 90 top
J7  60124102122403  [60124102122403]  139.45,34.3 270 top
J8  60124102122403  [60124102122403]  99.45,34.3 270 top
J9  60124102122403  [60124102122403]  99.45,74.3 270 top
J10  60124102122403  [60124102122403]  139.45,74.3 270 top
J11  60124102122403  [60124102122403]  109.45,32.3 90 top
J12  60124102122403  [60124102122403]  69.45,32.3 90 top
J13  60124102122403  [60124102122403]  99.45,82.3 270 top
J14  60124102122403  [60124102122403]  139.45,82.3 270 top
J15  60124102122403  [60124102122403]  109.45,24.3 90 top
J16  60124102122403  [60124102122403]  69.45,24.3 90 top
J17  691137910002  [691137910002]  5.4,73.35 90 top
JP2  [1X06]  14.82,3.94 180 top
JP3  [2X04]  6.58,64.88 0 top
JP4  FAN  [1X02]  23.35,86.3 270 top
JP5  LCD  [1X04]  32.62,3.8 180 top
L1  1.5µH  [0806]  31.15,81.45 180 top
L2  1.5µH  [0806]  42.65,83.5 0 top
L3  1.5µH  [0806]  42.65,81.25 0 top
L4  1.5µH  [0806]  103.95,9.4 180 top
L5  BLM15HB121SN1  [0402]  21.43,27.2 180 top
L6  BLM15HB121SN1  [0402]  55.35,67.3 0 top
L7  BLM15HB121SN1  [0402]  55.37,62.22 0 top
L8  75nH  [L0201]  72.44,39.44 0 top
L9  1.5µH  [0806]  103.95,7.1 180 top
L10  1.5µH  [0806]  115.45,7.3 0 top
L11  1.5µH  [0806]  115.45,9.8 0 top
L12  1.5µH  [0806]  58.95,10.55 180 top
L13  1.5µH  [0806]  69.9,7.7 0 top
L14  1.5µH  [0806]  58.9,8.4 180 top
L15  1.5µH  [0806]  69.9,10.2 0 top
L16  2.5nH  [L0201]  51.35,64.95 0 top
L17  1.5µH  [0806]  31.15,83.6 180 top
L18  75nH  [L0201]  72.44,37.77 0 top
L19  BLM15HB121SN1  [0402]  17.45,18.9 0 top
L20  BLM15HB121SN1  [0402]  17.25,24.48 0 top
L21  30nH  [L0201]  71.19,39.42 0 top
L22  8nH  [L0201]  52.8,64.95 0 top
L23  30nH  [L0201]  71.19,37.8 0 top
L24  2.5nH  [L0201]  51.3,63.35 0 top
L25  8nH  [L0201]  52.8,63.35 0 top
L26  2.5nH  [L0201]  54.35,64.9 0 top
L27  2.5nH  [L0201]  54.3,63.35 0 top
R1  5k  [R0201]  105.88,13.66 90 top
R2  20k  [R0201]  33.42,87.18 90 top
R3  5k  [R0201]  33.43,86.23 90 top
R4  10k  [R0201]  36.13,78.94 270 top
R5  10k  [R0201]  37.47,78.64 270 top
R6  10k  [R0201]  35.31,79.33 90 top
R7  10k  [R0201]  37.85,86.87 270 top
R8  20k  [R0201]  105.88,12.43 90 top
R9  2k  [R0201]  28.32,81.58 90 top
R10  10k  [R0201]  28.31,80.45 90 top
R11  8k  [R0201]  45.39,80.3 90 top
R12  10k  [R0201]  45.39,79.33 90 top
R13  23k  [R0201]  45.2,83.85 90 top
R14  10k  [R0201]  45.2,82.88 90 top
R15  1k  [R0201]  46.55,33.87 90 top
R16  1k  [R0201]  54,50.4 0 top
R17  294R  [R0201]  80.25,53.95 270 top
R18  17.8R  [R0201]  79.5,54.15 180 top
R19  10k  [R0201]  32.9,6.75 270 bottom
R20  10k  [R0201]  32.06,6.75 270 bottom
R21  10k  [R0201]  30.47,6.75 270 bottom
R22  10k  [R0201]  29.6,6.75 270 bottom
R23  22R  [R0201]  36.6,72.36 0 top
R24  22R  [R0201]  36.6,70.95 0 top
R25  22R  [R0201]  36.6,69.94 0 top
R26  22R  [R0201]  36.6,68.53 0 top
R27  22R  [R0201]  36.6,67.32 0 top
R28  22R  [R0201]  36.6,65.91 0 top
R29  22R  [R0201]  36.6,64.7 0 top
R30  22R  [R0201]  36.6,63.49 0 top
R31  50R  [R0201]  50.6,72.35 180 top
R32  525R  [R0201]  46.58,32.82 90 top
R33  3k2  [R0201]  50.75,59.8 0 top
R34  1k  [R0201]  48.78,35.37 90 top
R35  1.9k  [R0201]  48.8,34.17 90 top
R36  1k  [R0201]  49.87,37.27 90 top
R37  1k  [R0201]  49.89,35.97 90 top
R38  500R  [R0201]  60.95,34.75 270 top
R39  50R  [R0201]  63.05,53.7 90 top
R40  100R  [R0201]  62.1,53.95 0 top
R41  500R  [R0201]  71.2,58.1 90 top
R42  30R  [R0201]  66.75,47.75 0 top
R43  330R  [R0201]  65.7,47.55 90 top
R44  0R  [R0201]  63.1,48.4 90 top
R45  4.7k  [R0201]  86.97,72.99 0 top
R46  4.7k  [R0201]  86.25,82.03 270 top
R47  4.7k  [R0201]  86.94,83.18 270 top
R48  4.7k  [R0201]  126.69,73.11 0 top
R49  22R  [R0201]  2.4,60.75 0 top
R50  4.7k  [R0201]  7.9,57.7 180 top
R51  22R  [R0201]  10.75,53.69 0 top
R52  4.7k  [R0201]  1.22,51.1 90 top
R53  4.7k  [R0201]  1.45,48.88 180 top
R54  4.7k  [R0201]  1.5,45.51 0 top
R55  1k  [R0201]  125.2,84.1 180 top
R56  1k  [R0201]  122.45,23.1 180 top
R57  1k  [R0201]  82.35,22.55 0 top
R58  1k  [R0201]  84.45,22.55 0 top
R59  25R  [R0201]  62.35,34.5 0 top
R60  1k2_1%  [R0201]  9.1,20.6 270 top
R61  1k  [R0201]  10.12,24.98 270 bottom
R62  22R  [R0201]  5,60.74 0 top
R63  22R  [R0201]  7.6,60.73 0 top
R64  22R  [R0201]  10,60.72 0 top
R65  4.7k  [R0201]  9.5,59.44 180 top
R66  4.7k  [R0201]  7.1,59.45 180 top
R67  4.7k  [R0201]  4.5,59.46 180 top
R68  4.7k  [R0201]  2.4,59.43 0 top
R69  4.7k  [R0201]  35.15,48.65 0 top
R70  4.7k  [R0201]  126.68,83.01 180 top
R71  4.7k  [R0201]  127.74,82.8 270 top
R72  4.7k  [R0201]  122.12,34.87 180 top
R73  4.7k  [R0201]  121.74,24.27 90 top
R74  4.7k  [R0201]  120.84,24.3 90 top
R75  4.7k  [R0201]  81.97,33.99 180 top
R76  4.7k  [R0201]  81.34,22.71 90 top
R77  4.7k  [R0201]  80.54,22.69 90 top
R78  840R  [R0201]  125.47,83.03 0 top
R79  840R  [R0201]  122.98,24.33 180 top
R80  840R  [R0201]  82.33,23.88 180 top
R81  840R  [R0201]  83.23,23.87 180 top
R82  23k  [R0201]  101.3,9.45 90 top
R83  10k  [R0201]  17.57,16.3 0 bottom
R84  10k  [R0201]  15.53,15.78 0 bottom
R85  10k  [R0201]  108.58,13.28 180 top
R86  10k  [R0201]  111.15,13.38 180 top
R87  5k  [R0201]  61.42,13.75 90 top
R88  20k  [R0201]  61.43,12.52 270 top
R89  10k  [R0201]  101.32,8.47 90 top
R90  23k  [R0201]  101.41,6.65 90 top
R91  10k  [R0201]  101.43,5.67 90 top
R92  23k  [R0201]  118.24,5.95 90 top
R93  10k  [R0201]  118.24,4.83 90 top
R94  23k  [R0201]  117.96,10.02 90 top
R95  10k  [R0201]  117.96,8.9 90 top
R96  23k  [R0201]  56.01,11.34 90 top
R97  10k  [R0201]  63.94,5.97 180 top
R98  10k  [R0201]  65.59,5.38 0 top
R99  10k  [R0201]  63.63,13.33 270 top
R100  10k  [R0201]  65.75,13.48 270 top
R101  10k  [R0201]  56,10.37 90 top
R102  23k  [R0201]  55.95,7.45 90 top
R103  10k  [R0201]  55.95,6.38 90 top
R104  23k  [R0201]  72.72,7.52 90 top
R105  10k  [R0201]  72.72,6.45 90 top
R106  23k  [R0201]  72.77,10.48 90 top
R107  10k  [R0201]  72.77,9.56 90 top
R108  10k  [R0201]  49.2,27.95 90 bottom
R109  10k  [R0201]  49.23,26.76 270 bottom
R110  500R  [R0201]  43.8,27.05 0 top
R111  10k  [R0201]  5.6,11.95 90 top
R112  500R  [R0201]  43.79,26.08 0 top
R113  500R  [R0201]  43.79,25 0 top
R114  500R  [R0201]  43.84,23.77 0 top
R115  50R  [R0201]  50.4,63.6 270 top
R116  50R  [R0201]  50.45,64.7 90 top
R117  4.7k  [R0201]  50.65,55.9 180 top
R118  4.7k  [R0201]  42.66,42.71 270 top
R119  4.7k  [R0201]  41.89,42.71 270 top
R120  10k  [R0201]  109.44,4.84 90 top
R121  10k  [R0201]  110.31,4.84 90 top
R122  294R  [R0201]  78.7,53.95 270 top
R123  294R  [R0201]  80.1,51.5 270 top
R124  17.8R  [R0201]  79.25,51.35 180 top
R125  294R  [R0201]  78.6,51.7 90 top
R138  1k  [R0201]  6.6,45.05 0 top
R139  1k  [R0201]  6.6,44.2 0 top
R140  1k  [R0201]  6.7,43.15 0 top
R141  4.7k  [R0201]  6.7,42.05 0 top
R142  4.7k  [R0201]  17.8,63.9 270 top
R143  4.7k  [R0201]  6.7,40.8 180 top
R144  1k  [R0201]  6.7,39.7 180 top
R145  10k  [R0201]  14.55,15.93 90 bottom
R146  2.2k  [R0201]  17.57,15.7 180 bottom
R147  50R  [R0201]  49.85,39.55 0 top
R148  50R  [R0201]  49.9,38.85 0 top
R149  50R  [R0201]  48.35,39.5 0 top
R150  50R  [R0201]  48.35,38.85 0 top
R151  500R  [R0201]  61,36.75 90 top
R152  25R  [R0201]  62.6,37 0 top
R153  500R  [R0201]  59.2,39.45 0 top
R154  25R  [R0201]  59.45,40.2 90 top
R155  50R  [R0201]  56.2,34.45 0 top
R156  50R  [R0201]  57.95,32.6 90 top
R157  50R  [R0201]  54.5,34.5 0 top
R158  50R  [R0201]  57.9,30.85 90 top
R159  500R  [R0201]  59.2,32.85 180 top
R161  25R  [R0201]  59.65,31.25 180 top
S1  MOMENTARY-SWITCH-SPST-SMD-4.6X2.8MM  [TACTILE_SWITCH_SMD_4.6X2.8MM]  10.46,11.94 0 top
TP1  TP  [PAD.02X.02]  52.67,87.47 0 top
TP2  TP  [PAD.02X.02]  142.58,5.52 90 top
TP3  TP  [PAD.02X.02]  29.14,87.27 90 top
TP4  TP  [PAD.02X.02]  29.25,78.47 90 top
TP5  TP  [PAD.02X.02]  45.91,78.47 90 top
TP6  TP  [PAD.02X.02]  46.21,86.61 90 top
TP7  TP  [PAD.02X.02]  100.07,13.97 90 top
TP8  TP  [PAD.02X.02]  98.97,6.91 90 top
TP9  TP  [PAD.02X.02]  120.43,4.22 90 top
TP10  TP  [PAD.02X.02]  120.08,14.36 90 top
TP11  TP  [PAD.02X.02]  57.69,13.32 90 top
TP12  TP  [PAD.02X.02]  58.04,4.61 90 top
TP13  TP  [PAD.02X.02]  71.75,4.57 90 top
TP14  TP  [PAD.02X.02]  71.46,13.07 90 top
TP15  TP  [PAD.02X.02]  52.52,4.72 90 top
TP16  TP  [PAD.02X.02]  23.95,30.1 0 top
TP17  TP  [PAD.02X.02]  23.95,31 0 top
TP18  TP  [PAD.02X.02]  23.95,29.1 0 top
U1  MAX20029ATIA/V+  [21-0140L_T2855-5_MXM]  36.85,83.02 0 top
U2  STM32F746ZGT7  [LQFP-144_STM]  36.32,19.85 180 bottom
U3  AD9708AR  [RW_28_ADI]  43.82,64.14 0 top
U4  MAX1449EHJ+  [21-0110B_MXM]  43.18,37.83 180 top
U5  LTC5552IUDBTRMPBF  [UDB_12_ADI]  82.22,55.79 180 top
U6  FT2232HQ  [64QFN_FT2232HQ_FTD]  15.4,21.95 180 bottom
U7  ADF4382ABCCZ  [CC-48-10_ADI]  68.86,53.56 90 top
U8  LM2662MX/NOPB  [M08A]  56.66,83.75 180 top
U9  MT25QL01GBBB8E12-0AUT  [BGA24_MT25QL_MRN]  6.25,51.83 0 top
U10  SI5351A-B-GM  [QFN20_SIL]  57.21,50.45 0 top
U11  MTX2-143+  [DQ1225_MNC]  76.32,50.37 180 top
U12  MTX2-143+  [DQ1225_MNC]  76.32,54.8 180 top
U13  LTC5552IUDBTRMPBF  [UDB_12_ADI]  82.13,49.74 0 top
U14  SZMMSZ5232BT1G  [SOD-123_ONS]  88.59,52.28 180 top
U15  SZMMSZ5232BT1G  [SOD-123_ONS]  88.61,55.32 0 top
U16  EP4RKU+  [DG1677-2_MNC]  104.45,53.3 180 top
U18  ADAR1000ACCZN  [CC-88-1_ADI]  124.45,77.3 180 top
U19  ADAR1000ACCZN  [CC-88-1_ADI]  124.45,29.3 0 top
U20  ADAR1000ACCZN  [CC-88-1_ADI]  84.45,29.3 0 top
U21  ADTR1107ACCZ  [CC-24-8_ADI]  76.45,73.3 180 top
U22  ADTR1107ACCZ  [CC-24-8_ADI]  76.45,81.3 180 top
U23  ADTR1107ACCZ  [CC-24-8_ADI]  92.45,81.3 0 top
U24  ADTR1107ACCZ  [CC-24-8_ADI]  92.45,73.3 0 top
U25  ADTR1107ACCZ  [CC-24-8_ADI]  116.45,73.3 180 top
U26  ADTR1107ACCZ  [CC-24-8_ADI]  116.45,81.3 180 top
U27  ADTR1107ACCZ  [CC-24-8_ADI]  132.45,73.3 0 top
U28  ADTR1107ACCZ  [CC-24-8_ADI]  132.45,81.3 0 top
U29  ADTR1107ACCZ  [CC-24-8_ADI]  132.45,25.3 0 top
U30  ADTR1107ACCZ  [CC-24-8_ADI]  132.45,33.3 0 top
U31  ADTR1107ACCZ  [CC-24-8_ADI]  116.45,33.3 180 top
U32  ADTR1107ACCZ  [CC-24-8_ADI]  116.45,25.3 180 top
U33  ADTR1107ACCZ  [CC-24-8_ADI]  92.45,25.3 0 top
U34  ADTR1107ACCZ  [CC-24-8_ADI]  92.45,33.3 0 top
U35  ADTR1107ACCZ  [CC-24-8_ADI]  76.45,33.3 180 top
U36  ADTR1107ACCZ  [CC-24-8_ADI]  76.45,25.3 180 top
U37  LM2662MX/NOPB  [M08A]  135.18,8.56 0 top
U38  MAX20029ATIA/V+  [21-0140L_T2855-5_MXM]  109.94,9.11 0 top
U39  MAX20029ATIA/V+  [21-0140L_T2855-5_MXM]  64.75,9.67 0 top
U42  XC7A50T-2FTG256I  [BGA256C100P16X16_1700X1700X155]  24,52 0 top
U$1  M3SWA2-34DR+  [16_QFN]  95.59,53.34 270 top
U$2  BPF2  [BPF2]  81.85,58.25 0 top
U$3  BPF2  [BPF2]  100.25,47.55 180 top
X2  MINI-USB-32005-201  [32005-201]  5.05,23.43 180 bottom
XTAL1  NX3225GD-8MHZ-STD-CRA-3  [XTAL_NX3225GD-8MHZ-STD-CRA-3_N]  22.35,22.27 270 bottom
XTAL3  NX3215SA-32.768KHz  [XTAL_NX3225GD-8MHZ-STD-CRA-3_N]  22.46,14.74 270 bottom
XTAL4  CX3225SB25000D0FLJCC  [XTAL4_CX3225SB_AVX]  50.7,50.94 145 top
Y1  ECS-120-10-36B2-JTN-TR  [CRYSTAL-SMD-2X2.5MM]  7.2,15.3 270 bottom

## Tracks (layer width: path | path; a pad name or v marks a point on that pad's centre or on a via)
+1V  (via drill 0.2, 0.6)
  Top 0.1: U42.L8 U42.K9 U42.J8 v23,52 | U42.H9 v24,53 | U42.J6 v21,52 | U42.G6 v21,54 | U42.F7 v22,55 | v24,55 U42.F9 U42.E10 26,56 27,56 27,55 U42.F11 | C1.1 28.91,87.04 TP3.1 | U1.28 34.95,85.8 34.95,86.92 34.65,87.88 31.2,87.88 30.23,86.45 L17.2
  Top 0.2: L17.2 C1.1 26.8,84
  Top 1: 26.8,84 v26.25,84
  Route14 0.1: v23,52 22.75,52.25 | v24,53 23.75,53.25 | v21,52 21,52.25 | v21,54 21,54.25
  Route14 1: v26.25,84 23,74.65
  pour Route14: 20.5,51 24.5,51 24.5,75.5 20.5,75.5
+1V2
  Top 0.1: TP4.1 29.25,79.3 30.25,80.3 L1.2
  Top 0.3: L1.2 29.85,81.85 C9.1 28.95,81.83 R9.2 27.64,81.83 C10.1
+1V8  (via drill 0.15, 0.2, 0.6)
  Top 0.1: v27,50 U42.K11 v26,51 U42.J10 | U42.L10 v26,49 | U42.J2 v17,51 | U42.F1 v14.75,54.5 | U42.G8 v23,54 | U42.G10 v26,54 | U42.F8 v23,55 | U42.E4 v19,56 | U42.D7 v22,57 | U42.B3 v18,59 | U42.A6 v21.5,61 | C154.2 v14.25,53 | C55.2 v14.25,51.45 | C153.2 13.04,49.8 v14.25,49.8 | C157.2 13.02,48.25 v14.25,48.25 | v14.25,44.75 12.97,44.75 C158.2 C156.2 | 46.25,80.45 46.4,80.6 47.25,80.6 47.35,80.5 47.35,79.2 46.62,78.47 TP5.1 | C155.2 14.2,46.25 v14.25,46.3
  Top 0.2: L3.2 43.5,80.5 C11.1 R11.2 C12.1 44,80.6 44,80.75 46.25,80.75 46.25,80.85 | 46.25,80.85 43.95,80.85 43.95,81 46.25,80.95 | 46.25,80.95 46.25,80.85 | 46.25,80.95 46.25,81.1 44,81.1 44,80.45 46.25,80.45 46.25,81.25 43.95,81.25 43.95,81.45 46.25,81.45 46.25,81.3 46.2,81
  Top 1: 46.2,81 v50.15,81
  Route3 0.1: v27,50 27.25,50 | v26,49 26,48.75 | v26,51 26,50.75 | v17,51 16.75,51 | v14.75,54.5 14.75,54.25 | v23,54 23,54.25 | v26,54 26.25,54 | v23,55 22.75,55 | v19,56 18.75,56 | v22,57 21.75,57 | v18,59 17.75,59 | v21.5,61 21.25,61 | v14.25,51.45 14.5,51.5 | v14.25,49.8 14.25,50.25 | v14.25,48.25 14.5,48.25 | v14.25,44.75 14.5,44.75
  Route3 1: v50.15,81 arc-90 51.15,80 51.15,77.85 arc-90 50,76.7 30.55,76.7 arc90 19.1,65.25 19.1,61.8
  Bottom 0.1: v14.25,53 14.3,53.05 14.97,53.05 14.97,54.27 v14.75,54.5
  pour Route3: 14,39 14,62.5 27,62.5 27,39
+3V3  (via drill 0.15, 0.2, 0.6)
  Top 0.08: R138.1 6.35,44.62 6,44.62 6,42.35 6.03,42.33 6.45,42.33 6.45,42.08 R141.1 6.44,40.82 R143.2 R144.2 6.45,39.67 v6.45,39.2 | R15.2 45.58,34.12 45.58,37.05 45.6,37.08 46.38,37.08 U4.3 | v35.4,49.15 R69.2 | v48.27,35.62 R34.2 | R36.2 49.12,37.52 49.12,37.1 49.1,37.08 49.02,37.08 v48.95,37.1
  Top 0.1: U42.A16 v32,60 | U42.B13 v29,59 | U42.C10 v26,58 | U42.E14 v30,56 | U42.H15 31,53 v33,53 | U42.J12 v28,51 | U42.L6 v21,49 | U42.L16 v33,49.5 | U42.M13 v29,48 | U42.N10 v26,47 | U42.P7 v22,46 | U42.R14 v30,45 | U42.T11 v26,45 | R111.2 5.65,12.26 v5.65,12.7 | 46.84,84.54 46.84,85.98 TP6.1 | R50.2 7.45,57.7 v7,57.25 | U9.B4 6.82,52.4 6.8,52.4 6.7,52.3 4,52.3 3.9,52.4 2.3,52.4 1.25,51.35 R52.2 0.7,51.35 0.55,51.2 0.55,49.52 R53.2 1.2,45.56 R54.1 | R142.1 v17.8,64.7 | U42.M3 v19,49
  Top 0.2: 43.5,84 43.6,84.1 C13.1 R13.2 46.02,84.11 C14.1 46.78,84.12 46.78,84.48 46.84,84.54 | U10.10 v58.21,47.71 v58.2,47.7 | U10.11 v60,49.45 | U10.14 v60.1,50.95 | U10.18 v57.21,53.29 v57.2,53.3 | L5.2 v19.45,27.2 | v51.75,70.95 C37.1 48.68,70.95 U3.27 | U3.17 C41.1 51.13,58.43 v51.25,58.55 | v48.95,37.1 48.41,37.1 C46.2 C45.2 47.74,37.05 47.1,37.05 47.07,37.08 U4.3 | v46.05,42.3 46.05,41.97 C53.2 C51.2 44.95,41.13 U4.9 | v44.7,43.5 44.7,43.19 C47.2 C48.2 44.47,41.15 U4.10 | v36.3,37.5 37.02,37.6 C49.2 C52.2 U4.21 | C17.2 15.93,41.8 v15.95,41.8 | C108.2 17.53,41.7 v17.55,41.7 | C109.2 19.08,41.75 v19.1,41.75 | C110.2 20.63,41.75 v20.6,41.75 | C111.2 22.38,41.75 v22.35,41.75 | C112.2 24.13,41.75 v24.1,41.75 | C113.2 25.43,41.8 v25.4,41.8 | C176.2 v13.8,63.6 | C182.2 v13.7,62.35 | C181.2 v13.65,60.95 | C178.2 v13.6,59.55 | C177.2 12.9,58.2 v13.55,58.2 | C179.2 12.95,56.65 13,56.65 13,56.7 v13.6,56.7 | C180.2 12.95,54.95 v13.65,54.95 | C50.2 7,56.7 v7,57.25 | U9.B4 v7.75,53.3 | R65.2 8.66,59.44 v8.55,59.55 | R66.2 6.3,59.45 v6.2,59.55 | R68.2 2.69,59.46 R67.2 3.79,59.46 v3.45,59.8 | C192.2 v13.18,27.15 | C193.2 18.3,25.3 v18.15,25.45 | C194.2 v18.45,21.2 | C195.2 v15.62,16.27 | U42.T1 v16.95,44.95 | U42.R4 v19.95,45.95 | JP2.1 21.17,5.32 v22.5,6.65
  Top 0.3: U10.20 56.21,53.29 v56.15,53.35 | v58.25,67.05 58.17,66.97 C42.1 58.12,66.55 C40.1 56.54,67.3 L6.2 | L19.2 v18.1,19.98 | L20.2 18.48,24.48 18.52,24.43 v18.52,23.62
  Top 0.406: L2.2 43.5,84
  Top 1.2: 46.84,84.54 47.25,84.54 v47.28,84.51
  Route2 0.2: v6.2,59.55 6.2,59.65 6.15,59.7 | v3.45,59.8 3.45,60
  Route14 0.1: v32,60 32.25,60.25 | v29,59 29.25,59.25 | v26,58 26.25,58 | v30,56 30.25,56 | v33,53 33.25,53 | v28,51 28,50.75 | v21,49 20.75,49 | v33,49.5 33.25,49.5 | v29,48 29,47.75 | v26,47 26.25,47 | v22,46 21.75,46 | v30,45 30.25,45 | v26,45 26.25,45 | v5.65,12.7 5.65,12.9 | v49.2,28.75 49.2,29.15 | v49.2,26 49.2,25.85 | v19,49 19.05,49.05
  Route14 0.2: v58.2,47.7 58.2,47.6 | v60,49.45 60.2,49.45 | v60.1,50.95 60.3,50.95 | v57.2,53.3 57.2,53.45 57.15,53.5 | v23.35,19.1 28.65,19.15 | v28.95,32.7 29.1,32.7 | v49.25,10.85 47.9,10.85 47.8,10.75 | v38.95,7.1 38.85,7.2 | v49.25,17.4 49.15,17.3 | v27.15,13.6 27.35,13.6 | v45.8,30.55 45.9,30.55 46,30.45 | v19.45,27.2 19.3,27.2 19.25,27.15 | v51.75,70.95 51.95,70.95 52,70.9 | v51.25,58.55 51.3,58.55 51.45,58.7 | v48.95,37.1 49.2,37.1 | v46.05,42.3 45.95,42.4 45.85,42.4 | v44.7,43.5 44.8,43.6 44.8,43.7 | v36.3,37.5 36.45,37.85 36.35,37.85 | v15.95,41.8 15.95,41.95 16,41.95 | v17.55,41.7 17.55,41.9 | v19.1,41.75 19.1,41.9 | v20.6,41.75 20.5,41.75 | v22.35,41.75 22.35,41.7 22.2,41.7 | v24.1,41.75 24.1,41.9 24.15,41.9 | v25.4,41.8 25.2,41.8 | v13.8,63.6 13.8,63.55 14,63.55 | v13.7,62.35 13.9,62.35 | v13.65,60.95 13.85,60.95 | v13.6,59.55 13.6,59.45 13.85,59.45 | v13.55,58.2 13.55,58.35 | v13.6,56.7 13.75,56.7 | v13.65,54.95 13.85,54.95 | v7,57.25 7,57.45 | v7.75,53.3 7.8,53.45 | v8.55,59.55 8.55,59.6 8.45,59.7 | v18.15,25.45 18.15,25.57 | v18.45,21.2 18.32,21.2 | v15.62,16.27 15.62,16.25 15.68,16.2 | v18.62,16.3 18.62,16.1 | v9.72,25.68 9.72,25.82 | v16.85,16.38 16.85,16.48 16.82,16.5 | v14.53,6.08 14.88,6.08 14.9,6.05 | v16.95,44.95 17,45 | v19.95,45.95 20,46 | v22.5,6.65 22.7,6.85
  Route14 0.3: v56.15,53.35 56.15,53.4 56,53.55 | v58.25,67.05 58.25,67.1 58.35,67.2 | v18.1,19.98 18.1,20.27 | v18.52,23.62 18.52,23.43
  Route14 0.5: 24.5,43 26.5,43
  Route14 1.2: v47.28,84.51 47.28,74.87 47.37,74.78
  Bottom 0.08: U2.143 28.07,8.97 27.62,8.97 U2.144
  Bottom 0.1: R22.2 R21.2 R20.2 R19.2 33.6,6.5 33.85,6.75 v33.85,7.15 | R108.2 v49.2,28.75 | R109.2 49.23,26.03 v49.2,26 | v17.8,64.7 16,64.7 14.85,63.55 13.85,63.55 v13.8,63.6
  Bottom 0.2: v23.35,19.1 C25.1 25.65,19.15 U2.17 | v23.2,25.6 C26.1 U2.30 25.75,25.6 25.8,25.65 | v28.95,32.7 28.6,32.35 C27.1 28.6,30.54 U2.39 | v35.3,32.9 35.1,32.7 C28.1 35.1,30.54 U2.52 | v40.2,32.75 40.1,32.35 C29.1 40.05,30.55 U2.62 | v49.15,23 48.2,23.05 C31.1 46.7,23.1 | 46.65,23.1 46.7,23.1 | 46.7,23.1 U2.84 | v49.25,10.85 49.1,11.05 C32.1 U2.108 | v38.95,7.1 39.05,7.25 C33.1 39.05,9.15 U2.121 | v33.85,7.15 34.1,7.3 C34.1 34.05,9.15 U2.131 | v49.25,17.4 48.95,17.55 C30.1 U2.95 | v27.6,6.3 27.5,6.5 C35.1 27.55,8 27.55,9.15 U2.144 | U2.6 v27.15,13.6 | U2.72 45.78,30.57 v45.8,30.55 | v13.18,27.15 13.18,26.44 U6.20 | U6.31 18.65,25.95 v18.15,25.45 | U6.42 v18.45,21.2 | U6.56 15.65,16.3 v15.62,16.27 | v18.62,16.3 C190.2 18.62,17.46 U6.50 | R61.1 10.12,25.27 v9.72,25.68 | R83.2 16.93,16.3 v16.85,16.38 | C159.2 14.57,6.03 v14.53,6.08 14.49,6.11 IC1.8 14.5,9.8 15.12,10.43 15.12,15.12 15.27,15.27 R84.2 15.27,15.98 15.05,16.2 14.57,16.2 R145.2
  pour Route14: 25.6,75.6 62,75.5 62,45 49.65,45.15 49.65,5.65 1,5.5 1,39.5 25.4,39.4 25.4,62 25.5,62 25.5,75.5
  pour Route14: 1,68.5 15,68.5 15,50 25.5,50 25.5,39.5 1,39.5
+3V3_A1  (via drill 0.15, 0.2, 0.3, 0.4, 0.6)
  Top 0.1: 120.6,6.6 120.6,4.39 TP9.1
  Top 0.2: L10.2 116.46,7.3 C136.1 118.22,6.23 R92.2 C137.1 118.98,6.38 119,6.4 | 118.2,6.4 117.4,6.4 117.4,6.6 | 117.4,6.6 119,6.6 | 119,6.6 119,6.4 | 119,6.6 119,6.8 | 119,6.8 118.8,6.8 | 118.6,6.8 117.6,6.8 | 117.6,6.8 117.2,6.8 | 117.2,6.8 116.8,7.2 | 117.2,6.8 117.4,6.6 | 117.4,6.6 117.4,6.8 116.8,7.4 116.8,7.6 117.6,6.8 | 117.6,6.8 117.6,7 | 117.6,7 116.8,7.8 117,7.8 | 117,7.8 117.8,7 | 117.8,7 117.8,7.2 | 117.8,7.2 117.2,7.8 | 117,7.8 117.2,7.8 | 117.8,7.2 118,7 | 118,7 117.8,7 | 118,7 118.2,7 | 118.2,7 117.4,7.8 | 117.4,7.8 117.2,7.8 | 117.4,7.8 117.6,7.8 118.4,7 | 118.2,7 118.4,7 | 118.4,7 118.6,6.8 | 118.6,6.8 118.8,6.8 | 118.8,6.8 119,7 | 119,7 119.2,6.8 | 119.2,6.8 119.4,6.6 | 119.4,6.6 119.2,6.4 | 119.2,6.8 119.2,7 119,7 | 119,7 119,6.8 | 119,6.6 119.2,6.4 | 119.2,6.4 119,6.4 | 119,6.4 118.2,6.4 | 118.2,6.4 117.6,7 | 117.6,7 118.8,7 | 118.8,7 119,7 | 118.8,7 119.4,6.6 | R78.1 125.15,82.97 v125.15,82.45
  Top 0.3: v135.1,10.45 137.63,10.45 U37.8 | GND.N11 GND.M11 GND.M10 82.97,79.78 v82.97,79.31 | U18.N11 U18.M11 U18.M10 122.95,79.43 v122.97,79.3
  Top 1.2: 119.4,6.6 120.6,6.6 v121.4,7.6
  Route3 0.56: v82.8,72.2 87.4,67.6 121.88,67.6 122,67.6 122.95,68.55 v122.95,70.55
  Route3 1.2: v122.06,61.17 121.88,61.37 121.88,67.6
  Route14 0.2: v125.15,82.45 123.6,80.9 123.4,80.9
  Route14 0.3: 125.6,11.8 128.85,11.8 130.2,10.45 v135.1,10.45 | v82.97,79.31 82.99,79.29 82.99,78.77 | v122.97,79.3 122.97,78.97 122.9,78.9
  Route14 0.56: v82.8,72.2 82.7,72.3 82.9,72.3 83.55,72.95 83.55,78.6 82.99,78.77 | v122.95,70.55 122.85,70.65 122.85,72.4 123.3,72.85 123.3,78.5 122.9,78.9
  Route14 1.2: v121.4,7.6 125.6,11.8 125.6,16.6 144.45,16.6 144.5,16.55 144.5,43.74 v122.06,61.17
  pour Route14: 122,81 123.6,81 123.6,78.6 122,78.6
  pour Route14: 81.8,81.4 83.4,81.4 83.4,78.55 81.8,78.55
+3V3_A2  (via drill 0.15, 0.2, 0.3)
  Top 0.1: R79.1 125.17,22.4 v126.4,22.4 | R81.1 83.48,24.29 v84,24.8 | R80.1 82.58,23.32 v83.3,22.6 | 119.4,15.4 119.4,15.04 TP10.1
  Top 0.2: 116.55,10.4 117.15,10.4 C138.1 R94.2 C139.1 118.71,10.44 118.7,10.45 116.85,10.45 116.85,10.55 116.8,10.6 118.7,10.6 118.75,10.55 118.75,10.75 116.85,10.75 116.8,10.7 116.8,10.95 118.75,10.95 118.8,10.9 | 118.8,10.9 118.8,10.45 | 118.8,10.9 118.8,11.2 116.75,11.2 116.75,11.05 | 116.75,10.75 116.75,11.05 | 116.75,11.05 116.8,11.1 118.65,11.1 118.8,11.25 118.8,11.35 116.7,11.35 116.7,10.7 117.05,10.7 117.75,11.4
  Top 0.3: U20.M10 U20.M11 U20.N11 86.45,25.59 v86.54,25.5 | U19.M10 U19.M11 U19.N11 v126.45,25.24
  Top 0.56: L11.2 116.35,10.2 116.55,10.4 | 116.05,15.35 92.85,15.35 v86,22.2 | 117.75,13.65 116,15.4 119.4,15.4 v126.4,22.4
  Top 1.2: 117.75,11.4 117.75,13.65 116.05,15.35
  Route14 0.1: v84,24.8 85.95,24.8 86,24.75 | v83.3,22.6 85.85,22.6 86,22.75
  Route14 0.3: v126.45,25.24 126.46,25.46 126.4,25.4 | v86.54,25.5 86.1,25.5 86,25.4
  Route14 0.56: v86,22.2 86,22.75 86,24.75 86,25.4 | v126.4,22.4 126.4,25.4
  pour Route14: 85.4,27.4 87,27.4 87,25 85.4,25
  pour Route14: 125.4,27.6 127,27.6 127,25.2 125.4,25.2
+3V3_AD1  (via drill 0.15, 0.3)
  Top 0.1: C133.1 100.65,13.39 TP7.1
  Top 0.2: U$1.8 93.94,52.33 C81.1 C82.1 90.32,52.33 U14.1 90.73,52.28 v91.6,53.15
  Top 0.3: L4.2 102.77,9.68 C126.1 101.89,9.71 R82.2 100.67,9.71 C133.1
  Top 0.4: U22.19 74.83,77.95 v74.85,77.95 | U22.24 78.08,78.2 v78.1,78.2 | U21.19 74.83,70.05 v74.8,70.05 | U21.24 78.08,70.2 v78.1,70.2 | U23.19 94.08,84.65 v94.1,84.65 | U23.24 90.83,84.7 v90.8,84.7 | U24.19 94.08,76.8 v94.05,76.8 | U24.24 90.83,76.45 v90.85,76.45 | U26.19 114.83,78.05 v114.85,78.05 | U26.24 118.08,78 v118.1,78 | U25.19 114.83,70.05 v114.8,70.05 | U25.24 118.08,70.3 v118.1,70.3 | U28.19 134.07,84.65 v134.05,84.65 | U28.24 130.82,84.55 v130.8,84.55 | U27.19 134.07,76.9 v134.1,76.9 | U27.24 130.82,76.55 v130.85,76.55
  Top 0.406: C133.1 94.77,9.73 v82.75,21.75
  Route14 0.2: v91.6,53.15 91.6,68.8 92,69.2
  Route14 0.4: v74.85,77.95 74.85,77.75 74.75,77.75 | v78.1,78.2 78.1,77.9 | v74.8,70.05 74.8,69.8 74.75,69.8 | v78.1,70.2 78.1,69.8 | v94.1,84.65 94.1,85 94.05,85 | v90.8,84.7 90.8,84.95 90.9,84.95 | v94.05,76.8 94.05,77.1 94.1,77.1 | v90.85,76.45 90.85,76.75 90.95,76.75 | v114.85,78.05 114.85,77.75 114.8,77.75 | v118.1,78 118.1,77.75 | v114.8,70.05 114.8,69.5 114.6,69.5 | v118.1,70.3 118.1,70 118.05,70 | v134.05,84.65 134.05,84.9 | v130.8,84.55 130.8,84.85 130.85,84.85 | v134.1,76.9 134.1,77.2 134.15,77.2 | v130.85,76.55 130.85,76.75 | v82.7,53.2 82.7,68 82.95,68.25 v82.95,69.2
  Route14 0.406: 78.65,69.25 78.7,69.2 v82.95,69.2 89.75,69.2 | 89.75,69.2 90,69.45 | 89.75,69.2 92,69.2 114.1,69.2 114.4,69.5 114.6,69.5 115.15,68.95 129.65,68.95 130.05,69.35
  Bottom 0.4: v82.75,21.75 82.7,21.8 82.4,21.8 81.85,22.35 81.85,23.85 81.95,23.95 81.95,24.7 81.85,24.8 81.85,28 82.75,28.9 82.75,30.65 82.95,30.85 82.95,37.9 82.7,38.15 v82.7,53.2
  pour Route14: 89.5,86.05 95.5,86.05 95.4,69.05 89.4,69.05
  pour Route14: 73.6,85.75 79.6,85.75 79.6,68.75 73.6,68.75
  pour Route14: 113.5,85.85 119.5,85.85 119.5,68.85 113.5,68.85
  pour Route14: 129.3,85.85 135.3,85.85 135.3,68.85 129.3,68.85
+3V3_AD2  (via drill 0.15, 0.3)
  Top 0.2: L9.2 102.88,6.93 C134.1 101.44,6.93 R90.2 100.67,6.91 C135.1 98.99,6.93 TP8.1
  Top 0.4: U30.19 134.07,36.45 v134.05,36.45 | U30.24 130.82,36.4 v130.8,36.4 | U29.19 134.07,28.7 v134.1,28.7 | U29.24 130.82,28.45 v130.8,28.45 | U31.19 114.83,30 v114.85,30 | U31.24 118.08,30.1 v118.05,30.1 | U32.19 114.83,21.95 v114.8,21.95 | U32.24 118.08,22.1 v118.05,22.1 | U34.24 90.83,36.5 v90.8,36.5 | U34.19 94.08,36.65 v94.05,36.65 | U33.19 94.08,28.65 v94.1,28.65 | U33.24 90.83,28.55 v90.8,28.55 | U35.19 74.83,29.85 v74.8,29.85 | U35.24 78.08,30.05 v78.05,30.05 | U36.19 74.83,21.8 v74.8,21.8 | U36.24 78.08,21.85 v78.05,21.85
  Top 0.406: L9.2 95.25,7.1 v81.45,20.9
  Route14 0.2: v81.45,20.9 78.4,20.9 78.35,20.95 | 90.4,20.95 90.5,21.05 | 114.2,21.05 114.3,20.95 | 131.35,21.05 131.4,21